# EAGLE design EMS_V2_1f (EAGLE 5.11)
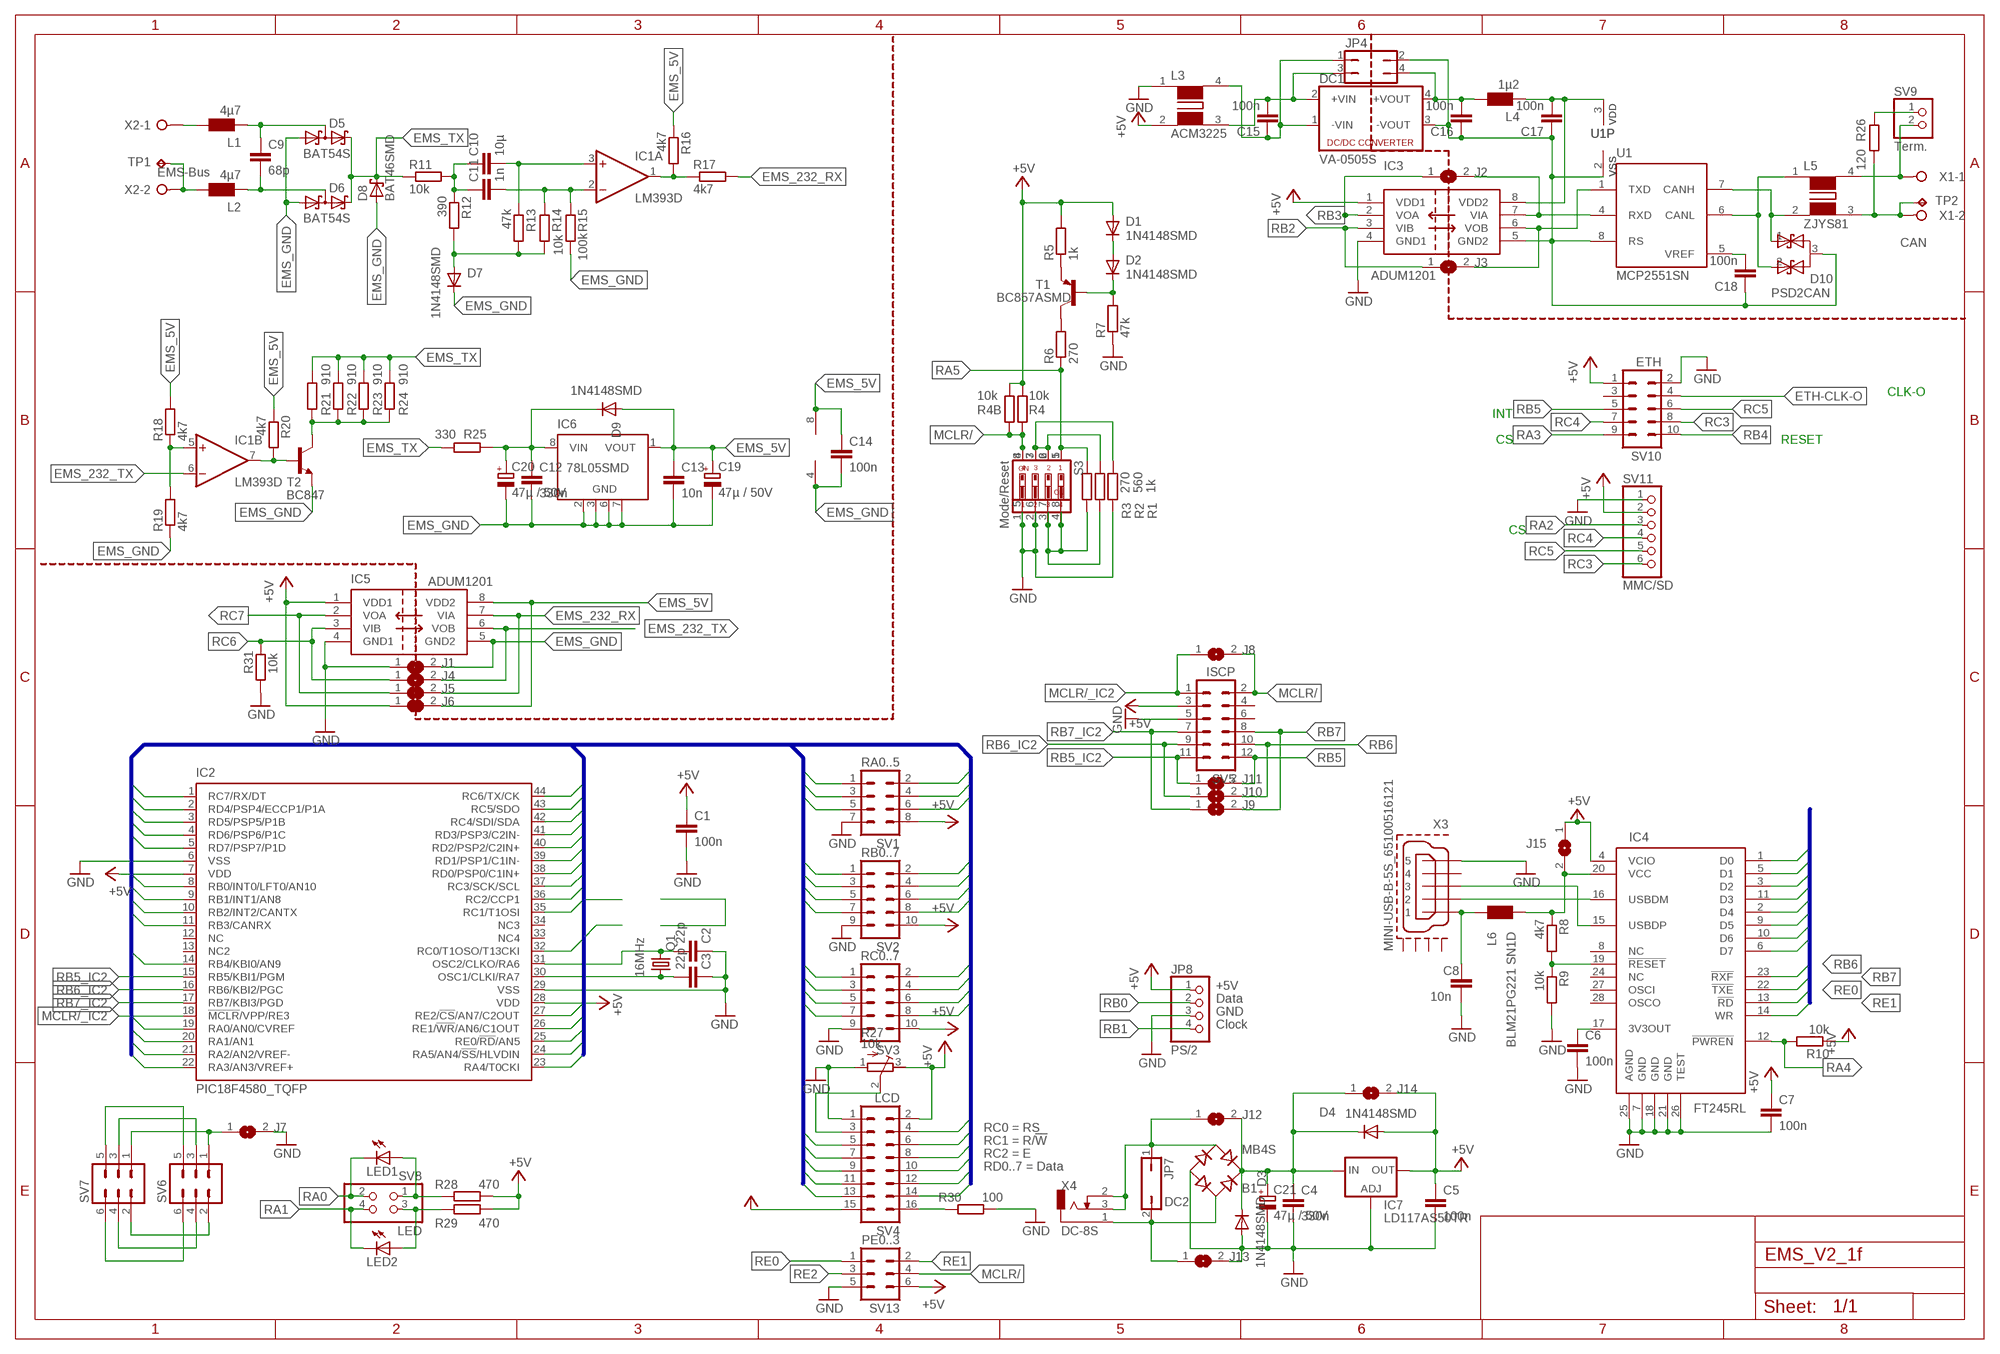
[diagram p0: schematic, sheet 1]

## Parts
B1  MB4S  [SOIC-4]
C1  100n  C-EUC0805  [C0805]
C2  22p  C-EUC0805  [C0805]
C3  22p  C-EUC0805  [C0805]
C4  330n  C-EUC0805  [C0805]
C5  100n  C-EUC0805  [C0805]
C6  100n  C-EUC0805  [C0805]
C7  100n  C-EUC0805  [C0805]
C8  10n  C-EUC0805  [C0805]
C9  68p  C-EUC0805  [C0805]
C10  10µ  C-EUC0805  [C0805]
C11  1n  C-EUC0805  [C0805]
C12  330n  C-EUC0805  [C0805]
C13  10n  C-EUC0805  [C0805]
C14  100n  C-EUC0805  [C0805]
C15  100n  C-EUC0805  [C0805]
C16  100n  C-EUC0805  [C0805]
C17  100n  C-EUC0805  [C0805]
C18  100n  C-EUC0805  [C0805]
C19  47µ / 50V  CPOL-EUE  [PANASONIC_E]
C20  47µ / 50V  CPOL-EUE  [PANASONIC_E]
C21  47µ / 50V  CPOL-EUE  [PANASONIC_E]
D1  1N4148SMD  [MINIMELF]
D2  1N4148SMD  [MINIMELF]
D3  1N4148SMD  [MINIMELF]
D4  1N4148SMD  [MINIMELF]
D5  BAT54S  [SOT23]
D6  BAT54S  [SOT23]
D7  1N4148SMD  [MINIMELF]
D8  BAT46SMD  [MINIMELF]
D9  1N4148SMD  [MINIMELF]
D10  PSD2CAN  [SOT23]
DC1  VA-0505S  [4SIL]
IC1  LM393D  [SO08]
IC2  PIC18F4580_TQFP  [TQFP44]
IC3  ADUM1201  [SO8]
IC4  FT245RL  [SSOP-28]
IC5  ADUM1201  [SO8]
IC6  78L05SMD  [SO08]
IC7  LD117AS50TR  [SOT223]
J1  SJ  [SJ]
J2  SJ  [SJ]
J3  SJ  [SJ]
J4  SJ  [SJ]
J5  SJ  [SJ]
J6  SJ  [SJ]
J7  SJ  [SJ]
J8  SJ  [SJ]
J9  SJ  [SJ]
J10  SJ  [SJ]
J11  SJ  [SJ]
J12  SJ  [SJ]
J13  SJ  [SJ]
J14  SJ  [SJ]
J15  SJ  [SJ]
JP4  JP2Q  [JP2Q]
JP7  DC2  JP1Q  [JP1]
JP8  PS/2  PINHD-1X4  [1X04]
L1  4µ7  WE-CBF_1210  [1210]
L2  4µ7  WE-CBF_1210  [1210]
L3  ACM3225  [ACM3225]
L4  1µ2  WE-CBF_1210  [1210]
L5  ZJYS81  [ZJYS81R5]
L6  BLM21PG221 SN1D  WE-KIHQ_0805  [WE-KI_0805_B]
LED1  LEDCHIPLED_1206  [CHIPLED_1206]
LED2  LEDCHIPLED_1206  [CHIPLED_1206]
Q1  16MHz  CRYSTALSM49  [SM49]
R1  1k  R-EU_R0805  [R0805]
R2  560  R-EU_R0805  [R0805]
R3  270  R-EU_R0805  [R0805]
R4  10k  R-EU_R0805  [R0805]
R4B  10k  R-EU_R0805  [R0805]
R5  1k  R-EU_R0805  [R0805]
R6  270  R-EU_R0805  [R0805]
R7  47k  R-EU_R0805  [R0805]
R8  4k7  R-EU_R0805  [R0805]
R9  10k  R-EU_R0805  [R0805]
R10  10k  R-EU_R0805  [R0805]
R11  10k  R-EU_R0805  [R0805]
R12  390  R-EU_R0805  [R0805]
R13  47k  R-EU_R0805  [R0805]
R14  10k  R-EU_R0805  [R0805]
R15  100k  R-EU_R0805  [R0805]
R16  4k7  R-EU_R0805  [R0805]
R17  4k7  R-EU_R0805  [R0805]
R18  4k7  R-EU_R0805  [R0805]
R19  4k7  R-EU_R0805  [R0805]
R20  4k7  R-EU_R0805  [R0805]
R21  910  R-EU_R0805  [R0805]
R22  910  R-EU_R0805  [R0805]
R23  910  R-EU_R0805  [R0805]
R24  910  R-EU_R0805  [R0805]
R25  330  R-EU_R0805  [R0805]
R26  120  R-EU_R0805  [R0805]
R27  10k  R-TRIMM3314J  [RTRIM3314J]
R28  470  R-EU_R0805  [R0805]
R29  470  R-EU_R0805  [R0805]
R30  100  R-EU_R0805  [R0805]
R31  10k  R-EU_R0805  [R0805]
S1  DHS104  [DHS104]
S3  Mode/Reset  SWS004  [SMS-004]
SV1  RA0..5  MA04-2  [MA04-2]
SV2  RB0..7  MA05-2  [MA05-2]
SV3  RC0..7  MA05-2  [MA05-2]
SV4  LCD  MA08-2  [MA08-2]
SV5  ISCP  MA06-2  [MA06-2]
SV6  MA03-2  [MA03-2]
SV7  MA03-2  [MA03-2]
SV8  LED  PINHD-2X2_2.54  [2X02]
SV9  Term.  PINHD-1X2  [1X02]
SV10  ETH  MA05-2  [MA05-2]
SV11  MMC/SD  PINHD-1X6  [1X06]
SV13  PE0..3  MA03-2  [MA03-2]
T1  BC857ASMD  [SOT23-BEC]
T2  BC847  [SOT23]
TP1  TPPAD1-13  [P1-13]
TP2  TPPAD1-13  [P1-13]
U1  MCP2551SN  [SO-08]
X1  CAN  W237-02P  [W237-132]
X2  EMS-Bus  W237-02P  [W237-132]
X3  MINI-USB-B-5S_65100516121  [65100516121]
X4  DC-8S  [DC-8S]

## Nets
+5V [Versorgung]: C1.1 C5.1 C7.1 D1.A D4.A IC2.7(VDD) IC2.28(VDD) IC3.1(VDD1) IC4.4(VCIO) IC5.1(VDD1) IC7.4(OUT) J6.1 J14.2 J15.1 JP8.1 L3.2 R4.1 R4B.1 R5.2 R10.1 R27.3(A) R28.1 R29.1 SV1.8 SV2.10 SV3.10 SV4.2 SV4.15 SV5.3 SV10.1 SV11.2 SV13.6
EMS_5V [Versorgung]: C13.1 C14.1 C19.+ D9.A IC1.8(P:V+) IC5.8(VDD2) IC6.1(VOUT) J6.2 R16.1 R18.2 R20.1
EMS_232_RX: IC5.7(VIA) J5.2 R17.2
EMS_232_TX: IC1.6(B:-IN) IC5.6(VOB) J4.2
EMS_GND [Versorgung]: C12.2 C13.2 C14.2 C19.- C20.- D5.1(A1) D6.1(A1) D7.C D8.A IC1.4(P:V-) IC5.5(GND2) IC6.2(GND) IC6.3(GND) IC6.6(GND) IC6.7(GND) J1.2 R15.2 R19.1 T2.2(E)
EMS_TX: D5.2(C2) D6.2(C2) D8.C R11.1 R21.1 R22.1 R23.1 R24.1 R25.1
ETH-CLK-O: SV10.4
GND [Versorgung]: B1.- C1.2 C2.1 C3.1 C4.2 C5.2 C6.2 C7.2 C8.2 C21.- D3.A IC2.6(VSS) IC2.29(VSS) IC3.4(GND1) IC4.7(GND) IC4.18(GND) IC4.21(GND) IC4.25(AGND) IC4.26(TEST) IC5.4(GND1) IC7.1(ADJ) J1.1 J7.2 J13.2 JP8.3 L3.1 R1.2 R7.1 R9.2 R27.1(E) R30.1 R31.2 S1.1 S1.2 S3.5 S3.6 SV1.7 SV2.9 SV3.9 SV4.1 SV5.5 SV10.2 SV11.1 SV13.5 X3.5
GND2 [Versorgung]: C16.1 C17.1 C18.1 D10.3 DC1.3(-VOUT) IC3.5(GND2) JP4.2 U1.2(VSS) U1.8(RS)
MCLR/: J8.2 R4.2 R4B.2 S1.8 S3.4 SV5.2 SV13.4
MCLR/_IC2: IC2.18(!MCLR!/VPP/RE3) J8.1 SV5.1
N$1: C9.2 D6.3(C1A2) L2.1
N$2: C2.2 IC2.31(OSC2/CLKO/RA6) Q1.2
N$3: C3.2 IC2.30(OSC1/CLKI/RA7) Q1.1
N$4: R27.2(S) SV4.3
N$5: R6.2 T1.C
N$6: IC3.6(VOB) J3.2 U1.1(TXD)
N$7: L2.2 TP1.TP X2.2
N$8: L1.2 X2.1
N$9: C10.1 C11.1 R11.2 R12.1
N$10: D7.A R12.2 R13.2 R14.2
N$11: IC1.1(A:OUT) R16.2 R17.1
N$12: C10.2 IC1.3(A:+IN) R13.1
N$13: C11.2 IC1.2(A:-IN) R14.1 R15.1
N$14: R5.1 T1.E
N$15: D10.1 L5.2 U1.7(CANH)
N$16: D10.2 L5.1 U1.6(CANL)
N$17: R1.1 R2.1 S1.6 S1.7 S3.2 S3.3
N$18 [Versorgung]: C12.1 C20.+ D9.C IC6.8(VIN) R25.2
N$19: R2.2 R3.2 S1.3 S1.4 S3.7 S3.8
N$20: L5.4 SV9.2 X1.1
N$21: R21.2 R22.2 R23.2 R24.2 T2.3(C)
N$22: IC1.5(B:+IN) R18.1 R19.2
N$23: IC1.7(B:OUT) R20.2 T2.1(B)
N$24: C9.1 D5.3(C1A2) L1.1
N$25: D1.C D2.A
N$26: C16.2 DC1.4(+VOUT) JP4.4 L4.2
N$27: L5.3 R26.1 TP2.TP X1.2
N$28: IC3.7(VIA) J2.2 U1.4(RXD)
N$29: J7.1 SV6.1 SV7.1
N$30: IC4.19(!RESET) R8.2 R9.1
N$31: SV6.3 SV7.3
N$32: SV6.5 SV7.5
N$33: D2.C R7.2 T1.B
N$34: B1.+ C4.1 C21.+ D3.C D4.C IC7.3(IN) J12.2 J14.1
N$35: SV6.2 SV7.2
N$36: C15.2 DC1.2(+VIN) JP4.3 L3.3
N$37: C15.1 DC1.1(-VIN) JP4.1 L3.4
N$38: SV6.4 SV7.4
N$39: C6.1 IC4.17(3V3OUT)
N$40: SV6.6 SV7.6
N$41: LED1.A R28.2 SV8.1
N$42: LED2.A R29.2 SV8.3
N$43: C18.2 U1.5(VREF)
N$44 [Versorgung]: B1.~1(AC1) J13.1 JP7.2 X4.1
N$45: R30.2 SV4.16
N$46: R26.2 SV9.1
N$47: B1.~2(AC2) J12.1 JP7.1 X4.2 X4.3
N$48: C8.1 L6.2 X3.1
RA0: IC2.19(RA0/AN0/CVREF) LED1.C SV1.1 SV8.2
RA1: IC2.20(RA1/AN1) LED2.C SV1.2 SV8.4
RA2: IC2.21(RA2/AN2/VREF-) SV1.3 SV11.3
RA3: IC2.22(RA3/AN3/VREF+) SV1.4 SV10.9
RA4: IC2.23(RA4/T0CKI) IC4.12(!PWREN) R10.2 SV1.5
RA5: IC2.24(RA5/AN4/!SS!/HLVDIN) R3.1 R6.1 S1.5 S3.1 SV1.6
RB0: IC2.8(RB0/INT0/LFT0/AN10) JP8.2 SV2.1
RB1: IC2.9(RB1/INT1/AN8) JP8.4 SV2.2
RB2: IC2.10(RB2/INT2/CANTX) IC3.3(VIB) J3.1 SV2.3
RB3: IC2.11(RB3/CANRX) IC3.2(VOA) J2.1 SV2.4
RB4: IC2.14(RB4/KBI0/AN9) SV2.5 SV10.10
RB5: J11.2 SV2.6 SV5.12 SV10.5
RB5_IC2: IC2.15(RB5/KBI1/PGM) J11.1 SV5.11
RB6: IC4.23(!RXF) J10.2 SV2.7 SV5.10
RB6_IC2: IC2.16(RB6/KBI2/PGC) J10.1 SV5.9
RB7: IC4.22(!TXE) J9.2 SV2.8 SV5.8
RB7_IC2: IC2.17(RB7/KBI3/PGD) J9.1 SV5.7
RC0: IC2.32(RC0/T1OSO/T13CKI) SV3.1 SV4.4
RC1: IC2.35(RC1/T1OSI) SV3.2 SV4.5
RC2: IC2.36(RC2/CCP1) SV3.3 SV4.6
RC3: IC2.37(RC3/SCK/SCL) SV3.4 SV10.8 SV11.6
RC4: IC2.42(RC4/SDI/SDA) SV3.5 SV10.7 SV11.4
RC5: IC2.43(RC5/SDO) SV3.6 SV10.6 SV11.5
RC6: IC2.44(RC6/TX/CK) IC5.3(VIB) J4.1 R31.1 SV3.7
RC7: IC2.1(RC7/RX/DT) IC5.2(VOA) J5.1 SV3.8
RD0: IC2.38(RD0/PSP0/C1IN+) IC4.1(D0) SV4.7
RD1: IC2.39(RD1/PSP1/C1IN-) IC4.5(D1) SV4.8
RD2: IC2.40(RD2/PSP2/C2IN+) IC4.3(D2) SV4.9
RD3: IC2.41(RD3/PSP3/C2IN-) IC4.11(D3) SV4.10
RD4: IC2.2(RD4/PSP4/ECCP1/P1A) IC4.2(D4) SV4.11
RD5: IC2.3(RD5/PSP5/P1B) IC4.9(D5) SV4.12
RD6: IC2.4(RD6/PSP6/P1C) IC4.10(D6) SV4.13
RD7: IC2.5(RD7/PSP7/P1D) IC4.6(D7) SV4.14
RE0: IC2.25(RE0/!RD!/AN5) IC4.13(!RD) SV13.1
RE1: IC2.26(RE1/!WR!/AN6/C1OUT) IC4.14(WR) SV13.2
RE2: IC2.27(RE2/!CS!/AN7/C2OUT) SV13.3
USB_VCC: IC4.20(VCC) J15.2 L6.1 R8.1
USBD+1: IC4.15(USBDP) X3.3
USBD-1: IC4.16(USBDM) X3.2
VCC2: C17.2 IC3.8(VDD2) L4.1 U1.3(VDD)
Unconnected: IC2.12(NC) IC2.13(NC2) IC2.33(NC4) IC2.34(NC3) IC4.8(NC) IC4.24(NC) IC4.27(OSCI) IC4.28(OSCO) IC6.4(NC) IC6.5(NC) SV5.4 SV5.6 SV10.3 X3.4 X3.S1(GND) X3.S2(GND) X3.S3(GND) X3.S4(GND)

## Buses
PORTS:RA[0..5],RB[0..7],RC[0..7],RD[0..7],RE[0..2]

## Notes on the sheet
- CLK-O
- INT
- CS | RESET
- CS
- +5V
- Data
- GND
- Clock
- RC0 = RS
- RC1 = R/!W!
- RC2 = E
- RD0..7 = Data

## Library data of the parts
B1 = rectifier:MB*S: Bridge Rectifier Source: http://www.fairchildsemi.com/ds/MB/MB6S.pdf
C1-C18 = rcl:C-EU: CAPACITOR, European symbol
C19-C21 = rcl:CPOL-EU: POLARIZED CAPACITOR, European symbol
D1-D4 D7 D9 = mod_diode:1N4148: DIODE high speed (Philips)
D5 D6 = mod_diode:BAT54S: Schottky Diodes Source: Fairchild .. BAT54.pdf
D8 = mod_diode:BAT46SMD
D10 = mod_diode:PSD2CAN: Dual Line CAN Bus Protector
DC1 = dc-dc-converter:VA-*?: DC DC Converter Single Output, 1 Watt Motien Technology Co.,Ltd. Source: va-serie.pdf; OC_FARNELL: unknown; OC_NEWARK: unknown
IC1 = linear:LM393: COMPARATOR
IC2 = microchip_mod:PIC18F4580_TQFP: Enhanced Flash Microcontrollers with ECAN Technology 10-Bit A/D an nanoWatt Technology Source: http://ww1.microchip.com/downloads/en/devicedoc/39637c.pdf
IC3 IC5 = adum140x:ADUM1201
IC4 = FTDI:FT245RL: FT245RL USB to parallel FIFO interface
IC6 = linear:78L*SMD: Positive VOLTAGE REGULATOR
IC7 = v-reg:LD117A?*: Low drop fixed and adjustable positive voltage regulators 1 A Source: http://www.st.com/stonline/products/literature/ds/7194/ld1117axx.pdf
J1-J15 = jumper:SJ: SMD solder JUMPER
JP4 = jumper:JP2Q: JUMPER
JP7 = jumper:JP1Q: JUMPER
JP8 = pinhead:PINHD-1X4: PIN HEADER
L1 L2 L4 = wuerth-elektronik:WE-CBF: SMD EMI Suppression Ferrite Beads - excellent anti-EMI properties - low DCR - impedances till 3000 ohms - rated current up to 6 A
L3 = TDK:ACM3225: TDK ACM3225 Common Mode Filters for Power Line SMD
L5 = TDK:ZJYS81: Common Mode Filters For automobile signal line ZJYS series
L6 = wuerth-elektronik:WE-KIHQ: SMD Wire Wound Ceramic Inductor WE-KIHQ - High current - Highest Quality factor in size 0805 - up to 98 - High thermal stability - High SRF -- Bluetooth -- Wireless LAN -- RF oscillation circuit -- IF impedance matching -- IG choke
LED1 LED2 = led:LED: LED OSRAM: - CHIPLED LG R971, LG N971, LY N971, LG Q971, LY Q971, LO R971, LY R971 LH N974, LH R974 LS Q976, LO Q976, LY Q976 LO Q996 - Hyper CHIPLED LW Q18S LB Q993, LB Q99A, LB R99A - SideLED LS A670, LO A670, LY A670, LG A670, LP A670 LB A673, LV A673, LT A673, LW A673 LH A674 LY A675 LS A676, LA A676, LO A676, LY A676, LW A676 LS A679, LY A679, LG A679 - Hyper Micro SIDELED® LS Y876, LA Y876, LO Y876, LY Y876 LT Y87S - SmartLED LW L88C, LW L88S LB L89C, LB L89S, LG L890 LS L89K, LO L89K, LY L89K LS L896, LA L896, LO L896, LY L896 - TOPLED LS T670, LO T670, LY T670, LG T670, LP T670 LSG T670, LSP T670, LSY T670, LOP T670, LYG T670 LG T671, LOG T671, LSG T671 LB T673, LV T673, LT T673, LW T673 LH T674 LS T676, LA T676, LO T676, LY T676, LB T676, LH T676, LSB T676, LW T676 LB T67C, LV T67C, LT T67C, LS T67K, LO T67K, LY T67K, LW E67C LS E67B, LA E67B, LO E67B, LY E67B, LB E67C, LV E67C, LT E67C LW T67C LS T679, LY T679, LG T679 LS T770, LO T770, LY T770, LG T770, LP T770 LB T773, LV T773, LT T773, LW T773 LH T774 LS E675, LA E675, LY E675, LS T675 LS T776, LA T776, LO T776, LY T776, LB T776 LHGB T686 LT T68C, LB T68C - Hyper Mini TOPLED® LB M676 - Mini TOPLED Santana® LG M470 LS M47K, LO M47K, LY M47K Source: http://www.osram.convergy.de LUXEON: - LUMILED® LXK2-PW12-R00, LXK2-PW12-S00, LXK2-PW14-U00, LXK2-PW14-V00 LXK2-PM12-R00, LXK2-PM12-S00, LXK2-PM14-U00 LXK2-PE12-Q00, LXK2-PE12-R00, LXK2-PE12-S00, LXK2-PE14-T00, LXK2-PE14-U00 LXK2-PB12-K00, LXK2-PB12-L00, LXK2-PB12-M00, LXK2-PB14-N00, LXK2-PB14-P00, LXK2-PB14-Q00 LXK2-PR12-L00, LXK2-PR12-M00, LXK2-PR14-Q00, LXK2-PR14-R00 LXK2-PD12-Q00, LXK2-PD12-R00, LXK2-PD12-S00 LXK2-PH12-R00, LXK2-PH12-S00 LXK2-PL12-P00, LXK2-PL12-Q00, LXK2-PL12-R00 Source: www.luxeon.com KINGBRIGHT: KA-3528ASYC Source: www.kingbright.com
Q1 = crystal:CRYSTAL: CRYSTAL; OC_FARNELL: unknown; OC_NEWARK: unknown
R1-R4 R4B R5-R26 R28-R31 = resistor:R-EU_: RESISTOR, European symbol
R27 = resistor:R-TRIMM: Trimm resistor
S1 = switch-dil_mod:DHS104
S3 = smd-special:SWS004: SMD Dip Switch 4 pol.
SV1 = con-lstb:MA04-2: PIN HEADER; OC_FARNELL: unknown; OC_NEWARK: unknown
SV2 SV3 SV10 = con-lstb:MA05-2: PIN HEADER; OC_FARNELL: unknown; OC_NEWARK: unknown
SV4 = con-lstb:MA08-2: PIN HEADER; OC_FARNELL: unknown; OC_NEWARK: unknown
SV5 = con-lstb:MA06-2: PIN HEADER; OC_FARNELL: unknown; OC_NEWARK: unknown
SV6 SV7 SV13 = con-lstb:MA03-2: PIN HEADER; OC_FARNELL: unknown; OC_NEWARK: unknown
SV8 = pinhead:PINHD-2X2: PIN HEADER
SV9 = pinhead:PINHD-1X2: PIN HEADER
SV11 = pinhead:PINHD-1X6: PIN HEADER
T1 = transistor-pnp:BC857*: PNP Transistror
T2 = transistor:BC847: NPN TRANSISTOR
TP1 TP2 = testpad:TP: Test pad
U1 = microchip_can:MCP2551: High Speed CAN tranceiver
X1 X2 = con-wago-508:W237-02P: WAGO SREW CLAMP; OC_FARNELL: unknown; OC_NEWARK: unknown
X3 = wuerth:MINI-USB-B-5S_65100516121: Würth SMT Mini-USB Type B 5Polig mit Schirm
X4 = con-dc:DC-8S

## Net classes
0 default: width 0.356 mm, clearance 0.15 mm
1 Versorgung: width 0.914 mm, clearance 0.15 mm

## Board
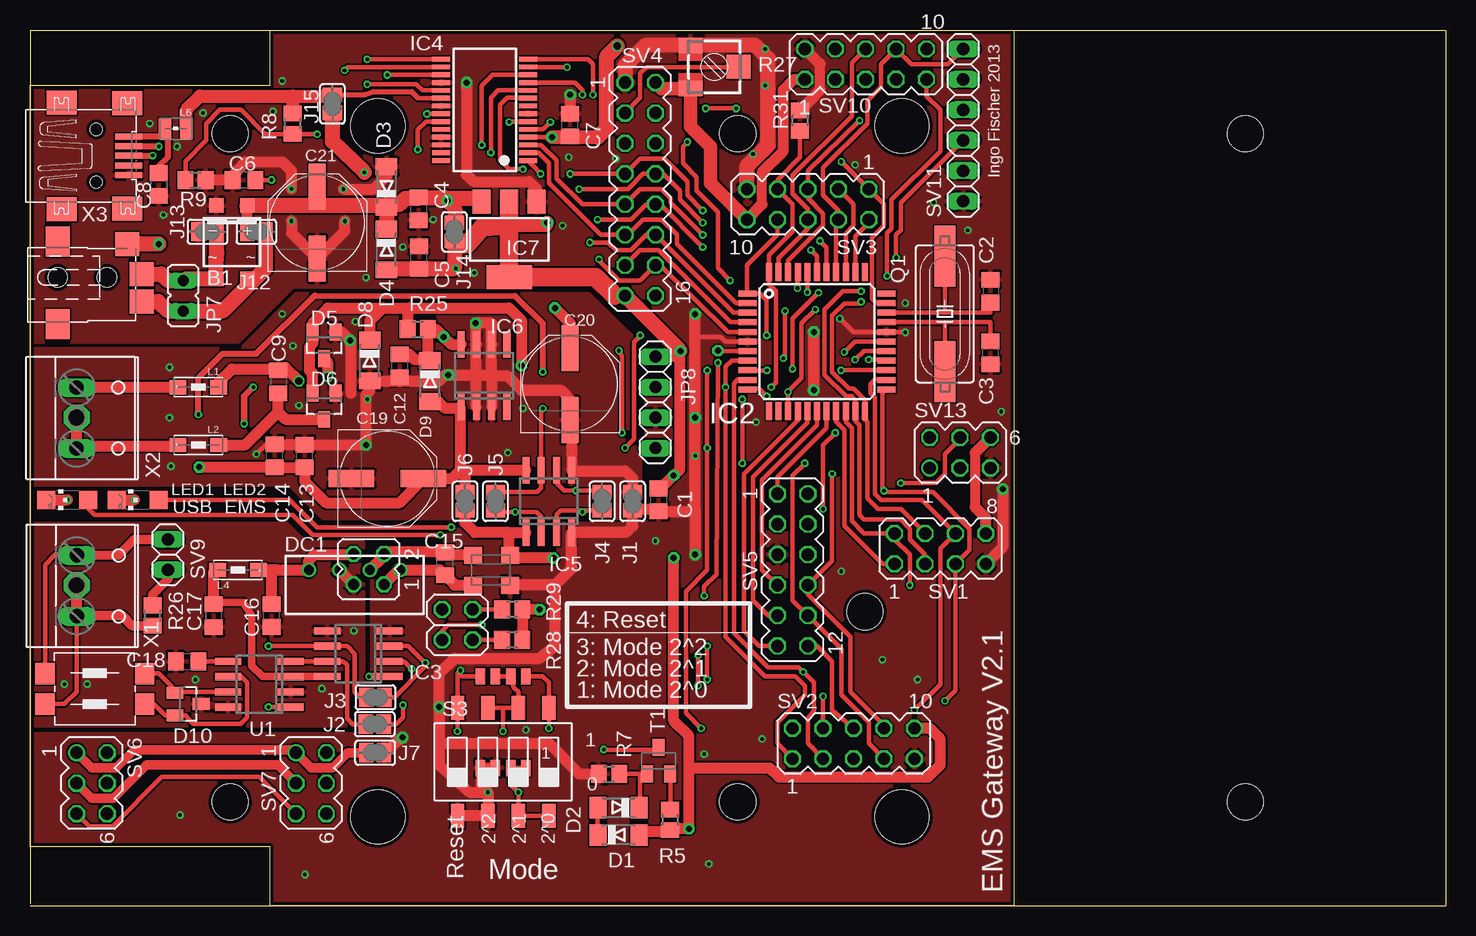
[diagram p1: board, top side]
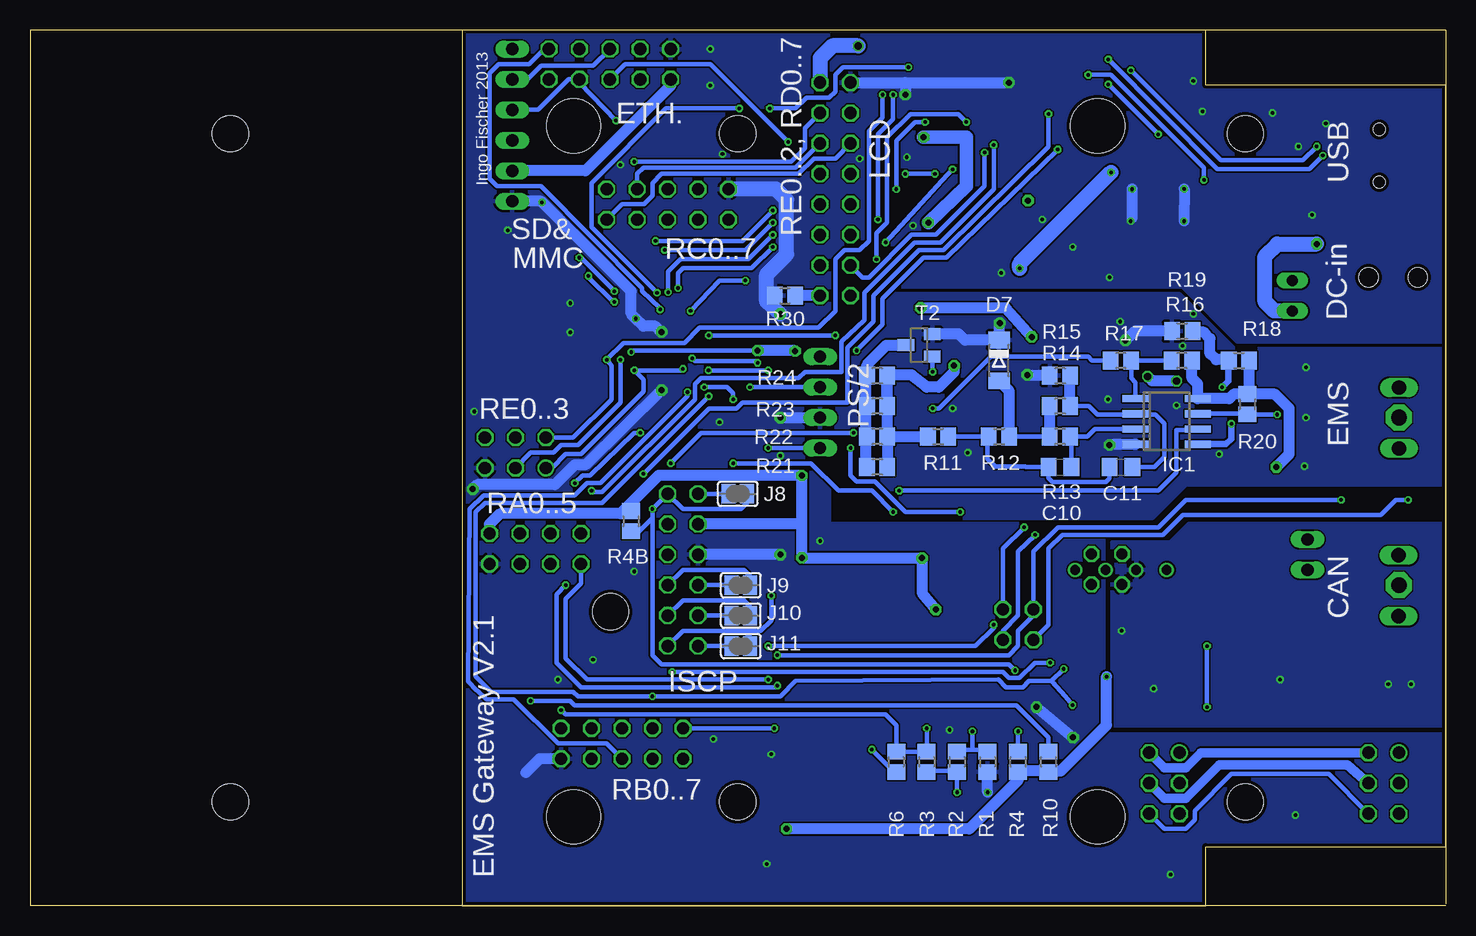
[diagram p2: board, bottom side, seen from below]

Size 118 x 73 mm. Coordinates in mm from the lower left corner, seen from the top.
Outline: 0,0.13 0,73 118,73 118,0 0,0
Outline: 82,0 20,0 20,4.9 0,4.9 0,68.4 20,68.4 20,73 82,73 82,0
Copper layers (1*16): Top 0.035mm / dielectric 1.5mm / Bottom 0.035mm
Design rules "PCB-POOL Standard": minimum track width 0.15mm, minimum drill 0.3mm, track to track 0.15mm, track to pad 0.15mm, pad to pad 0.15mm, via to via 0.15mm, smd to smd 0.15mm, copper to edge 0.3mm, drill to drill 0.2mm, minimum pad ring 0.2mm, minimum via ring 0.15mm, stop-mask expansion 0.075mm, vias tented up to drill 0mil, thermal gap 0.2mm
Holes 4.5 mm at 72.7,7.4 29,7.4 72.7,65 29,65
Holes 3 mm at 16.7,8.65 59,8.65 69.6,24.5 16.7,64.35 59,64.35 101.3,8.65 101.3,64.35
bKeepout: area 69.9,4.7 to 75.4,10.2; area 26.2,4.7 to 31.8,10.2; area 69.9,62.2 to 75.4,67.8; area 26.2,62.2 to 31.8,67.8; area 13.7,5.7 to 19.7,11.7; area 56,5.7 to 62,11.7; area 66.6,21.5 to 72.6,27.5; area 13.7,61.4 to 19.7,67.4; area 56,61.4 to 62,67.4; area 98.3,5.7 to 104.3,11.7; area 98.3,61.4 to 104.3,67.4

### Footprints (pad centres in the part's own frame; a part is rotated, then mirrored left to right if it is on the bottom)
SOIC-4 = smd 1.2 x 1.2: + 1.3,3.05; - -1.3,3.05; ~1 -1.3,-3.05; ~2 1.3,-3.05
C0805 = smd 1.3 x 1.5: 1 -0.95,0; 2 0.95,0
PANASONIC_E = smd 3.8 x 1.4: + 3,0; - -3,0
MINIMELF = smd 1.4 x 1.8: A 1.7,0; C -1.7,0
SOT23 = smd 1 x 1.4: 1 -0.95,-1.1; 2 0.95,-1.1; 3 0,1.1
4SIL = drill 0.8 round: 1 -3.81,0; 2 -1.27,0; 3 1.27,0; 4 3.81,0
SO08 = smd 0.6 x 2.2: 1 -1.905,-2.6; 2 -0.635,-2.6; 3 0.635,-2.6; 4 1.905,-2.6; 5 1.905,2.6; 6 0.635,2.6; 7 -0.635,2.6; 8 -1.905,2.6
TQFP44 = smd 1.5 x 0.5: 1 -5.8,4; 2 -5.8,3.2; 3 -5.8,2.4; 4 -5.8,1.6; 5 -5.8,0.8; 6 -5.8,0; 7 -5.8,-0.8; 8 -5.8,-1.6; 9 -5.8,-2.4; 10 -5.8,-3.2; 11 -5.8,-4; 23 5.8,-4; 24 5.8,-3.2; 25 5.8,-2.4; 26 5.8,-1.6; 27 5.8,-0.8; 28 5.8,0; 29 5.8,0.8; 30 5.8,1.6; 31 5.8,2.4; 32 5.8,3.2; 33 5.8,4 | smd 0.5 x 1.5: 12 -4,-5.8; 13 -3.2,-5.8; 14 -2.4,-5.8; 15 -1.6,-5.8; 16 -0.8,-5.8; 17 0,-5.8; 18 0.8,-5.8; 19 1.6,-5.8; 20 2.4,-5.8; 21 3.2,-5.8; 22 4,-5.8; 34 4,5.8; 35 3.2,5.8; 36 2.4,5.8; 37 1.6,5.8; 38 0.8,5.8; 39 0,5.8; 40 -0.8,5.8; 41 -1.6,5.8; 42 -2.4,5.8; 43 -3.2,5.8; 44 -4,5.8
SO8 = smd 0.6 x 2.2: 1 -1.905,-2.6; 2 -0.635,-2.6; 3 0.635,-2.6; 4 1.905,-2.6; 5 1.905,2.6; 6 0.635,2.6; 7 -0.635,2.6; 8 -1.905,2.6
SSOP-28 = smd 0.4 x 1.5: 1 -4.225,-3.625; 2 -3.575,-3.625; 3 -2.925,-3.625; 4 -2.275,-3.625; 5 -1.625,-3.625; 6 -0.975,-3.625; 7 -0.325,-3.625; 8 0.325,-3.625; 9 0.975,-3.625; 10 1.625,-3.625; 11 2.275,-3.625; 12 2.925,-3.625; 13 3.575,-3.625; 14 4.225,-3.625; 15 4.225,3.625; 16 3.575,3.625; 17 2.925,3.625; 18 2.275,3.625; 19 1.625,3.625; 20 0.975,3.625; 21 0.325,3.625; 22 -0.325,3.625; 23 -0.975,3.625; 24 -1.625,3.625; 25 -2.275,3.625; 26 -2.925,3.625; 27 -3.575,3.625; 28 -4.225,3.625
SOT223 = smd 1.5 x 2: 1 -2.3,-3.15; 2 0,-3.15; 3 2.3,-3.15 | smd 3.8 x 2: 4 0,3.15
SJ = smd 1.168 x 1.6: 1 -0.762,0; 2 0.762,0
JP2Q = drill 0.914 octagon: 1 -1.27,-1.27; 2 -1.27,1.27; 3 1.27,-1.27; 4 1.27,1.27
JP1 = drill 0.914 long: 1 0,-1.27; 2 0,1.27
1X04 = drill 1.016 long: 1 -3.81,0; 2 -1.27,0; 3 1.27,0; 4 3.81,0
1210 = smd 1.4 x 1.2: 1 -1.7,0; 2 1.7,0
ACM3225 = smd 1.5 x 1.4: 1 -1.6,1.3; 2 -1.6,-1.2; 3 1.5,-1.2; 4 1.5,1.3
ZJYS81R5 = smd 1.6 x 1.8: 1 -4.15,1.27; 2 -4.15,-1.27; 3 4.15,1.27; 4 4.15,-1.27
WE-KI_0805_B = smd 1.02 x 1.78: 1 -0.89,0; 2 0.89,0
CHIPLED_1206 = smd 1.5 x 1.5: A 0,-1.75; C 0,1.75
SM49 = smd 5.08 x 1.778: 1 -4.826,0; 2 4.826,0
R0805 = smd 1.3 x 1.5: 1 -0.85,0; 2 0.85,0
RTRIM3314J = smd 1.3 x 2: 1 -1.8,-2; 3 1.8,-2 | smd 2 x 2: 2 0,2
DHS104 = smd 0.8 x 1.35: 1 -1.906,-3.823; 2 -0.635,-3.823; 3 0.635,-3.823; 4 1.906,-3.823; 5 1.905,3.825; 6 0.635,3.822; 7 -0.634,3.825; 8 -1.905,3.825
SMS-004 = smd 1.092 x 2.007: 1 -3.81,-4.496; 2 -1.27,-4.496; 3 1.27,-4.496; 4 3.81,-4.496; 5 3.81,4.496; 6 1.27,4.496; 7 -1.27,4.496; 8 -3.81,4.496
MA04-2 = drill 1.016 octagon: 1 -3.81,-1.27; 2 -3.81,1.27; 3 -1.27,-1.27; 4 -1.27,1.27; 5 1.27,-1.27; 6 1.27,1.27; 7 3.81,-1.27; 8 3.81,1.27
MA05-2 = drill 1.016 octagon: 1 -5.08,-1.27; 2 -5.08,1.27; 3 -2.54,-1.27; 4 -2.54,1.27; 5 0,-1.27; 6 0,1.27; 7 2.54,-1.27; 8 2.54,1.27; 9 5.08,-1.27; 10 5.08,1.27
MA08-2 = drill 1.016 octagon: 1 -8.89,-1.27; 2 -8.89,1.27; 3 -6.35,-1.27; 4 -6.35,1.27; 5 -3.81,-1.27; 6 -3.81,1.27; 7 -1.27,-1.27; 8 -1.27,1.27; 9 1.27,-1.27; 10 1.27,1.27; 11 3.81,-1.27; 12 3.81,1.27; 13 6.35,-1.27; 14 6.35,1.27; 15 8.89,-1.27; 16 8.89,1.27
MA06-2 = drill 1.016 octagon: 1 -6.35,-1.27; 2 -6.35,1.27; 3 -3.81,-1.27; 4 -3.81,1.27; 5 -1.27,-1.27; 6 -1.27,1.27; 7 1.27,-1.27; 8 1.27,1.27; 9 3.81,-1.27; 10 3.81,1.27; 11 6.35,-1.27; 12 6.35,1.27
MA03-2 = drill 1.016 round: 1 -2.54,-1.27 | drill 1.016 octagon: 2 -2.54,1.27; 3 0,-1.27; 4 0,1.27; 5 2.54,-1.27; 6 2.54,1.27
2X02 = drill 1.016 octagon: 1 -1.27,-1.27; 2 -1.27,1.27; 3 1.27,-1.27; 4 1.27,1.27
1X02 = drill 1.016 long: 1 -1.27,0; 2 1.27,0
1X06 = drill 1.016 long: 1 -6.35,0; 2 -3.81,0; 3 -1.27,0; 4 1.27,0; 5 3.81,0; 6 6.35,0
SOT23-BEC = smd 1 x 1.4: B -0.95,-1.1; C 0,1.1; E 0.95,-1.1
P1-13 = drill 1.321 pad 2.159 octagon: TP 0,0
SO-08 = smd 0.6 x 2.2: 1 -1.905,-2.6; 2 -0.635,-2.6; 3 0.635,-2.6; 4 1.905,-2.6; 5 1.905,2.6; 6 0.635,2.6; 7 -0.635,2.6; 8 -1.905,2.6
W237-132 = drill 1.194 long: 1 -2.54,-0.635; 2 2.54,-0.635
65100516121 = smd 2.25 x 0.5: 1 8.555,1.6; 2 8.555,0.8; 3 8.555,0; 4 8.555,-0.8; 5 8.555,-1.6 | smd 2.5 x 2: S1 2.98,4.45; S2 2.98,-4.45; S3 8.43,4.4; S4 8.43,-4.4 | hole 1: 5.85,2.2; 5.85,-2.2
DC-8S = smd 2 x 2: 1 9.5,0.3; 2 9.5,-2; 3 8.3,2.8 | smd 2 x 2.5: 4@1 2.5,3; 4@2 2.5,-3.9 | hole 1.6: 2.5,0; 6.6,0

### Placement (x,y rotation side)
B1  16.83,55.31 0 top
C1  52.41,33.82 270 top
C2  80.08,51.22 270 top
C3  80.08,46.08 90 top
C4  32.39,58.08 270 top
C5  32.43,54.02 90 top
C6  17.85,60.49 180 top
C7  45.03,65.07 90 top
C8  10.74,60.11 270 top
C9  20.71,43.67 270 top
C10  32.14,36.56 0 bottom
C11  27.06,36.55 0 bottom
C12  30.8,45.01 270 top
C13  22.9,37.48 90 top
C14  20.39,37.51 90 top
C15  34.61,28.49 90 top
C16  20.15,24.18 90 top
C17  15.33,24.16 90 top
C18  13.1,20.36 0 top
C19  29.79,35.6 0 top
C20  45.03,43.48 90 top
C21  23.95,56.94 90 top
D1  49.06,5.88 0 top
D2  49.06,8.17 180 top
D3  29.71,59.91 90 top
D4  29.71,54.7 270 top
D5  24.52,46.71 180 top
D6  24.52,41.63 180 top
D7  37.22,45.45 270 bottom
D8  28.33,45.45 270 top
D9  33.34,43.73 270 top
D10  13.18,16.8 270 top
DC1  27.06,27.98 180 top
IC1  23.25,40.36 270 bottom
IC2  65.6,47.03 0 top
IC3  27.38,21 90 top
IC4  37.92,66.34 90 top
IC5  43.25,33.7 0 top
IC6  37.85,44.17 0 top
IC7  39.95,55.54 180 top
J1  50.23,33.7 90 top
J2  28.74,15.12 180 top
J3  28.8,17.35 180 top
J4  47.7,33.7 90 top
J5  38.8,33.7 90 top
J6  36.27,33.7 90 top
J7  28.77,12.74 0 top
J8  59,34.33 0 bottom
J9  58.74,26.71 0 bottom
J10  58.74,24.17 0 bottom
J11  58.74,21.63 0 bottom
J12  18.87,56.18 180 top
J13  14.8,56.18 180 top
J14  35.38,56.18 270 top
J15  25.22,66.84 90 top
JP4  28.24,28.04 90 top
JP7  12.77,50.84 0 top
JP8  52.14,41.95 270 top
L1  14.04,43.22 180 top
L2  14.04,38.4 180 top
L3  38.42,27.98 180 top
L4  17.34,27.98 0 top
L5  5.4,18.08 180 top
L6  12.15,64.78 180 top
LED1  3.12,33.82 90 top
LED2  8.96,33.82 90 top
Q1  76.27,49.34 90 top
R1  38.17,11.98 270 bottom
R2  40.71,11.98 270 bottom
R3  43.26,11.98 270 bottom
R4  35.63,11.98 90 bottom
R4B  67.89,32.05 270 bottom
R5  53.35,7.15 270 top
R6  45.79,11.98 270 bottom
R7  48.27,10.96 0 top
R8  21.88,65.18 270 top
R9  13.8,60.48 0 top
R10  33.09,11.98 90 bottom
R11  42.3,39.09 0 bottom
R12  37.22,39.09 0 bottom
R13  32.14,39.09 180 bottom
R14  32.14,41.63 180 bottom
R15  32.14,44.17 180 bottom
R16  21.98,45.45 180 bottom
R17  27.06,45.45 180 bottom
R18  17.21,45.45 0 bottom
R19  21.95,47.89 0 bottom
R20  16.52,41.79 270 bottom
R21  47.38,36.55 180 bottom
R22  47.38,39.09 180 bottom
R23  47.38,41.63 180 bottom
R24  47.38,44.17 180 bottom
R25  32.33,48.05 0 top
R26  10.23,24.17 90 top
R27  57.05,69.92 270 top
R28  40.2,22.14 180 top
R29  40.2,24.68 180 top
R30  55.06,50.84 0 bottom
R31  64.2,65.45 90 top
S1  39.44,15.28 0 top
S3  39.44,11.98 180 top
SV1  75.89,29.76 0 top
SV2  68.65,13.5 0 top
SV3  64.84,58.46 180 top
SV4  50.87,59.73 270 top
SV5  63.57,27.98 270 top
SV6  5.15,10.2 270 top
SV7  23.44,10.2 270 top
SV8  35.63,23.41 90 top
SV9  11.5,29.25 90 top
SV10  69.67,70.15 0 top
SV11  77.79,65.07 90 top
SV13  77.54,37.76 0 top
T1  52.39,12.08 0 top
T2  43.88,46.71 90 bottom
TP1  3.88,40.68 90 top
TP2  3.88,26.71 90 top
U1  19.12,18.45 90 top
X1  4.54,26.66 270 top
X2  4.52,40.64 270 top
X3  -0.34,62.5 0 top
X4  -0.18,52.37 0 top

### Tracks (layer width: path | path; a pad name or v marks a point on that pad's centre or on a via)
+5V  (via drill 0.3, 0.5 pad 0.95, 0.6)
  Top 0.356: v43.5,64.06 IC4.4 41.53,64.05 | 54.17,46.27 v54.21,46.23 | v67.89,46.14 68.78,47.03 IC2.28 | IC2.7 57.38,46.23 v57.35,46.27 | 39.95,56.68 40.2,56.56
  Top 0.61: v28.26,19.09 IC3.1
  Top 0.813: 61.03,58.46 61.03,61.13 | 78.81,33.19 78.81,37.76
  Top 0.914: C7.1 44.97,64.06 arc90 C7.1 | SV3.10 | SV3.10 60.01,57.45 SV3.10 | SV3.10 | SV2.10 75,14.77 75.89,13.89 75.89,11.73 74.87,10.71 62.43,10.71 61.66,11.47 54.93,11.47 | 54.17,45.76 54.17,46.27 | 54.17,45.76 54.17,36.36 v53.66,35.86 52.65,34.84 C1.1 | 54.17,45.76 JP8.1 | C7.1 45.03,64.05 | D1.A 50.87,6.14 53.16,6.14 R5.2 53.66,6.39 v54.93,6.39 54.93,11.47 | 54.93,11.47 54.93,14.14 53.66,15.41 v53.66,29 | v43.63,28.97 40.24,28.97 L3.2 39.95,29.18 39.95,31.1 | J6.1 36.27,31.92 37.09,31.1 39.95,31.1 | R28.1 R29.1 v42.49,24.68 | 39.95,31.1 41.12,31.1 41.22,31.08 IC5.1 | 35.38,53.13 v35.5,53.13 35.44,53.07 35.25,53.07 | R27.3 55.06,68.11 | 29.98,53.07 29.91,53 29.91,53.07 | 61.03,61.13 62.81,62.91 62.81,67.99 63.7,68.88 SV10.1 | SV3.10 61.03,58.46 | 78.81,37.76 SV13.6 | SV1.8 79.7,32.3 78.81,33.19
  Top 1.143: SV3.10 56.71,60.24 56.71,63.29 55.06,64.94 55.06,68.11 | 45.03,64.05 47.31,64.05 | v43.5,64.06 44.97,64.06 | R27.3 52.65,68.12 SV4.2 | 43,56.81 v43.12,56.94 | 35.38,54.91 35.38,55.16 J14.2
  Top 1.27: 54.17,46.27 SV4.15 48.71,50.84 | D4.A 29.78,53.07 29.91,53.07 29.98,53.07 C5.1 35.25,53.07 | 35.38,54.91 35.38,53.13 | J15.1 25.22,63.67 v27.88,61.13 | 39.95,56.81 43,56.81 | 39.95,56.81 40.08,56.56 39.95,56.56 | 39.95,56.81 40.2,56.56 | 47.31,64.05 48.08,64.81 48.08,70.78 v48.97,71.67
  Top 1.524: 48.71,50.84 47.16,52.39 IC7.4 39.95,56.56 39.95,56.68 | 39.95,56.68 39.95,56.81 39.95,58.84 | 39.95,56.68 37.74,56.56 36.47,55.16 35.38,55.16
  Bottom 0.254: v53.66,29 53.63,28.97
  Bottom 0.356: v54.21,46.23 54.25,46.27 | v67.89,46.14 67.63,46.27 v57.35,46.27 | 68.78,32.68 68.27,32.68 R4B.1 | 39.95,59.99 40.46,59.22 40.46,59.07 42.72,56.81 v43.12,56.94
  Bottom 0.914: v53.66,29 53.66,31.79 | v28.26,19.09 28.26,15.03 32.07,11.22 32.84,11.22 R10.1 33.09,11.22 35.63,11.22 R4.1 35.63,10.46 39.69,6.39 v54.93,6.39 | 53.66,31.79 SV5.3 | 53.66,31.79 v53.66,35.86 65.6,35.86 68.78,32.68 78.81,32.68 79.06,32.43 79.7,31.79 SV1.8 | 54.25,46.27 v57.35,46.27 | 39.95,64.06 39.94,64.06 | 53.63,28.97 v43.63,28.97 43.63,26.08 v42.49,24.68 | SV11.2 71.7,61.26 64.59,68.37 SV10.1
  Bottom 1.143: v43.12,56.94 39.95,59.99 39.95,64.06 v43.5,64.06
  Bottom 1.27: v27.88,61.13 35.5,53.51 v35.5,53.13 | v48.97,71.67 51.12,71.67 52.14,70.65 SV4.2
EMS_5V  (via drill 0.5 pad 0.95)
  Top 0.15: 35.88,41.44 IC6.1
  Top 0.914: 36.27,36.3 IC5.8 | 35.88,36.3 36.27,36.3 | 36.27,36.3 J6.2 | 35.88,36.3 35.88,41.44 34.61,41.44 34.03,42.03 D9.A | v14.1,36.56 C14.1 20.39,36.53 C13.1 22.91,35.37 24.71,33.57 30.8,33.57 32.69,35.48 | 35.88,36.3 35.19,35.6 32.84,35.6 32.69,35.48 | C19.+ 32.79,35.58 32.69,35.48
  Bottom 0.914: R20.1 17.67,42.64 18.04,42.27 IC1.8 20.65,43.48 21.13,43.96 R16.1 | R20.1 arc90 16.45,42.71 | R18.2 16.37,42.89 16.52,42.89 R20.1 | v14.1,36.56 13.02,37.63 13.02,41.44 14.22,42.64 R20.1
EMS_232_RX  (via drill 0.3)
  Top 0.356: J5.2 42.27,34.46 42.62,34.81 IC5.7 42.62,41.32 v42.74,41.44
  Bottom 0.356: R17.2 29.47,45.45 29.79,45.76 37.92,45.76 42.23,41.44 v42.74,41.44
EMS_232_TX  (via drill 0.3)
  Top 0.356: IC5.6 43.88,35.22 44.52,34.59 v45.54,34.59 47.57,34.59 arc-90 J4.2
  Bottom 0.356: v45.54,34.59 23.95,34.59 22.42,36.11 22.42,39.67 20.71,39.67 IC1.6
EMS_GND  (via drill 0.3, 0.5 pad 0.95)
  Top 0.356: C14.2 19.69,38.46 v18.87,37.63
  Top 0.914: J1.2 50.23,35.6 49.6,36.24 45.22,36.24 IC5.5 45.16,42.08 44.27,42.97 40.96,42.97 39.76,44.18 38.49,44.18 | D6.1 25.62,42.59 | 37.15,46.84 v37.15,48.56 38.42,48.56 38.49,48.49 IC6.6 38.49,44.18 | 37.15,46.84 IC6.7 | 37.15,46.84 37.15,41.64 IC6.2 | 38.49,44.18 IC6.3 | 38.49,44.18 38.42,44.24 v34.87,44.24 34.61,44.24 34.12,43.75 31.06,43.75 | 31.06,43.75 D8.A 28.33,42.9 28.01,42.59 v28.01,38.4 C13.2 C14.2 | 25.96,47.82 25.98,47.82 26.74,47.05 26.74,42.71 | 25.96,47.82 D5.1 | v26.69,47.11 25.96,47.82 | C12.2 30.8,44 31.06,43.75
  Bottom 0.356: v37.15,48.56 37.22,48.49 | v28.01,38.4 28.01,38.46
  Bottom 0.914: T2.2 40.58,47.67 40.06,47.14 D7.C 37.22,48.49 | R15.2 33.05,44.24 v34.87,44.24 | 28.01,38.46 IC1.4 | v26.69,47.11 25.88,47.89 R19.1
  other vias: 11.63,44.87 11.75,36.62 27.12,48.68 21.02,49.32 11.63,40.68 39.82,37.76 41.09,41.44 28.14,42.21 22.42,41.7 21.91,46.65
  pour Bottom: 0.07,35.09 0.07,46.4 17.6,46.4 22.17,50.97 46.55,50.97 50.87,46.78 50.87,32.3 24.45,32.3 21.66,35.09
  pour Top: 0.07,35.09 0.07,46.4 17.6,46.4 22.17,50.97 46.55,50.97 50.87,46.78 50.87,32.3 24.45,32.3 21.66,35.09
EMS_TX  (via drill 0.5 pad 0.95)
  Top 0.356: 28.36,48.78 28.33,48.78 | 31.57,49.83 31.48,49.48
  Top 0.61: 28.33,48.78 28.93,49.32
  Top 0.914: 28.33,48.78 D8.C | 29.41,49.83 28.36,48.78 | 29.41,49.83 31.57,49.83 39.92,49.83 40.96,48.78 v40.96,45 | 31.48,49.48 R25.1 | 29.41,49.83 24.84,49.83 23.57,48.56 D5.2 23.57,46.91 23.31,46.52 23.31,44.62 23.57,44.36 D6.2
  Bottom 0.914: R23.1 46.55,41.7 46.55,44.15 R24.1 46.55,43.98 | R23.1 46.55,41.44 | 46.55,39.16 R22.1 | R22.1 R21.1 | 46.55,41.61 46.55,39.16 | 46.55,41.61 R23.1 | R22.1 R11.1 46.49,39.1 46.55,39.16 | 46.55,41.61 46.55,44.24 44.52,44.24 43.25,43.22 42.23,43.22 40.96,44.49 v40.96,45
GND  (via drill 0.3, 0.5 pad 0.95)
  Top 0.15: R7.1 47.57,10.96
  Top 0.356: 55.44,47.41 57.6,47.41 57.98,47.03 IC2.6 | 71.36,47.79 IC2.29 71.44,47.79 | v67.51,48.94 68.65,47.79 71.44,47.79 | 71.44,47.79 v72.97,47.79 | 37.66,11.47 S1.1
  Top 0.381: R31.2 64.2,66.21
  Top 0.813: 65.86,67.99 65.86,70.15
  Top 0.914: 36.39,68.11 36.4,68.61 | S3.5 S3.6 v38.17,9.44 36.65,9.44 34.11,11.73 34.11,13.5 | R7.1 45.79,10.96 43.25,13.5 34.11,13.5 | 55.44,33.06 v55.44,40.68 55.44,47.41 v55.44,49.32 | 55.44,33.06 v55.44,29.25 | 34.11,13.5 v34.11,16.55 34.11,19.35 35.38,20.62 42.49,20.62 43.76,21.63 43.76,26.71 | v81.1,34.71 81.1,29.89 SV1.7 | v45.03,67.61 45.03,66.08 45.28,66.08 C7.2 | 36.39,68.11 36.39,60.94 36.96,60.37 41.6,60.37 42.23,59.73 IC7.1 | v36.39,68.62 36.39,68.11 | L3.1 arc-90 39.95,26.61 40.31,26.61 40.41,26.71 43.76,26.71 | 15.27,60.51 16.92,60.51 C6.2 16.9,60.81 17.72,61.76 17.98,62.02 21.02,62.02 21.79,61.26 v21.79,59.75 | v65.35,42.97 v65.35,47.83 | J7.2 v31.06,14.01 | 38.68,11.42 38.68,11.47 37.79,11.47 | 37.66,11.35 37.66,11.47 37.79,11.47 | 37.66,9.57 37.66,11.35 | 37.66,11.35 37.79,11.47 | 55.44,33.06 55.25,32.87 C1.2 52.39,33.06 50.62,33.06 J1.1 50.23,31.63 49.76,31.16 45.47,31.16 IC5.4 45.16,28.11 43.76,26.71 | 64.2,66.21 65.86,67.99 | 65.86,70.15 SV10.2 | v26.25,57.07 26.25,56.24 C21.- 21.8,56.08 v21.8,57.07 | v26.12,59.73 28.64,59.73 29.79,60.88 29.79,61.53 D3.A
  Top 1.27: SV3.9 59.76,61.64 61.54,63.42 61.54,68.11 61.53,70.65 60.47,71.72 R27.1 51.3,71.72 49.6,70.02 SV4.1
  Bottom 0.356: v26.25,57.07 26.12,57.32
  Bottom 0.914: v38.17,9.44 R1.2 | v55.44,29.25 SV5.5 | v55.44,40.68 JP8.3 | 76.65,11.09 75.51,12.23 SV2.9 | 45.03,68.62 v36.39,68.62 | 45.03,68.62 v45.03,67.61 | v81.1,34.71 80.71,35.09 74.24,35.09 72.59,36.75 71.7,36.75 v65.35,42.97 | v65.35,47.83 65.39,47.83 65.86,48.3 66.87,48.3 v67.51,48.94 67.89,49.32 67.89,51.22 75.38,58.72 SV11.1 | v31.06,14.01 v34.11,16.55 | 49.6,68.75 SV4.1 45.03,68.62 | 26.12,57.32 v26.12,59.73 | v21.79,59.75 v21.8,57.07 | SV3.9
  Bottom 1.27: v55.44,49.32 56.59,50.33 56.59,52.62 54.93,54.27 54.93,58.84 55.82,59.73 SV3.9
  other vias: 72.97,50.23 80.97,41.19 78.17,56.3 14.42,66.08 20.26,66.21 9.98,65.19 11.12,57.57 22.93,2.58 12.52,7.54 56.59,3.47 41.34,14.65 73.98,18.84 61.28,68.37 75.32,58.63 44.39,56.68 12.26,63.29 21.02,68.75 44.9,62.4 71.06,20.49 67.63,27.86 28.01,52.37 37.03,52.75 68.78,61.76 52.14,30.4 56.2,12.62 61.03,13.89 33.61,57.19 31.07,54.91 48.84,62.27 60.27,62.65 55.44,37.51 60.52,40.3 61.28,71.42
  pour Bottom: 0.07,47.03 17.34,47.03 21.91,51.6 46.81,51.6 51.38,47.29 51.38,31.79 28.52,31.79 28.52,14.27 0.07,14.27 0.07,4.88 20.01,4.88 20.01,-0.08 82.11,-0.08 81.98,72.94 20.01,72.94 20.01,68.37 0.07,68.37
  pour Top: 0.07,47.03 17.34,47.03 21.91,51.6 46.81,51.6 51.38,47.29 51.38,31.79 28.52,31.79 28.52,14.27 0.07,14.27 0.07,4.88 20.01,4.88 20.01,-0.08 82.11,-0.08 81.98,72.94 20.01,72.94 20.01,68.37 0.07,68.37
GND2  (via drill 0.3)
  Top 0.356: 25.29,22.88 24.79,22.88 IC3.5
  Top 0.914: JP4.2 25.82,27.95
  other vias: 26.99,22.9 24.33,18.08 13.79,18.84 2.86,18.46 4.77,18.46
  pour Top: 27.76,15.03 0.07,15.03 0.07,31.79 21.41,31.79 22.93,30.27 27.76,30.27
  pour Bottom: 27.76,15.03 0.07,15.03 0.07,31.79 21.41,31.79 22.93,30.27 27.76,30.27
MCLR/  (via drill 0.3)
  Top 0.356: 35.65,19.36 v35.88,19.6 | S3.4 35.63,19.09 35.65,19.36 | S3.4 35.63,16.3 | v35.63,14.52 S3.4 | 35.65,19.36 35.65,19.33 36.01,19.09 S1.8 | SV13.4 77.54,38.9 76.27,37.63 76.27,35.98 75.51,35.22 v72.59,35.22 | v66.11,33.06 66.11,38.4 v67.13,39.41
  Bottom 0.356: R4.2 v35.63,14.52 | v35.88,19.6 36.39,20.11 65.35,20.11 66.11,20.87 66.11,32.3 | J8.2 58.24,33.57 58.74,33.06 63.57,33.06 SV5.2 v66.11,33.06 66.11,32.3 | v72.59,35.22 71.95,35.86 71.32,35.86 67.63,39.41 v67.13,39.41 | R4B.2 67.21,31.2 66.11,32.3
MCLR/_IC2
  Top 0.356: IC2.18 66.4,39.83 62.3,35.73 SV5.1
  Bottom 0.356: J8.1 SV5.1
N$1
  Top 0.914: L2.1 17.95,38.4 20.71,41.16 | D6.3 21.33,40.53 20.71,41.16 | 20.71,41.16 C9.2
N$2
  Top 0.356: IC2.31 76.27,49.43 | 76.27,49.43 Q1.2 | 76.27,49.43 80.08,49.43 C2.2
N$3
  Top 0.356: IC2.30 76.27,48.63 | 76.27,48.63 Q1.1 | 76.27,48.63 80.08,48.63 C3.2
N$4
  Top 0.356: R27.2 59,69.92 59,69.89 51.38,69.89 50.87,69.38 50.87,67.35 SV4.3
N$5  (via drill 0.3)
  Top 0.356: v47.82,13 52.39,13 T1.C
  Bottom 0.356: v47.82,13 46.04,11.22 R6.2
N$6  (via drill 0.3)
  Top 0.356: J3.2 28.01,17.31 27.5,17.31 27.06,17.76 27.06,21 26.42,21.63 IC3.6 v19.88,21.63 | v19.88,16.55 20.96,16.55 U1.1
  Bottom 0.356: v19.88,16.55 v19.88,21.63
N$7
  Top 0.356: X2.2 3.94,38.3 | TP1.TP
  Top 0.914: X2.2 TP1.TP | 3.94,38.3 12.25,38.3 L2.2
N$8
  Top 0.356: X2.1 3.91,43.22
  Top 0.914: 3.91,43.22 L1.2
N$9
  Bottom 0.356: R11.2 R12.1 38.17,38.99 38.17,37.22 37.54,36.59 35.03,36.59 34.99,36.56 C10.1 33.09,35.63 32.77,35.32 28.3,35.32 28.01,35.61 C11.1
N$10
  Bottom 0.356: R13.2 R12.2
  Bottom 0.914: R13.2 R14.2 | R12.2 36.37,42.89 D7.A
N$11
  Bottom 0.356: R16.2 R17.1 26.21,43.96 25.85,43.6 IC1.1
N$12
  Bottom 0.356: R13.1 31.34,39.04 | C10.2 31.19,39 R13.1 | IC1.3 29.22,39.73 29.85,39.1 R13.1
N$13
  Bottom 0.15: R14.1 31.31,41.7
  Bottom 0.356: 31.31,44.15 R15.1 | R14.1 29.72,41.64 29.03,40.94 25.91,40.94 arc-90 IC1.2 25.78,40.94 24.2,40.94 23.44,40.17 23.44,37.38 24.26,36.56 C11.2
  Bottom 0.914: R15.1 31.31,43.98 | 31.31,41.7 31.31,44.15
N$14
  Top 0.356: T1.E 53.41,10.96 53.41,8.17 R5.1
N$15
  Top 0.356: 15.75,17.82 U1.7 11.83,17.82 | 11.83,17.82 D10.1 | 11.83,17.82 11.83,18.26 10.74,19.35 L5.2
N$16
  Top 0.356: U1.6 17.6,19.09 18.1,18.58 18.1,15.69 17.57,15.16 13.61,15.16 13.02,15.79 12.97,15.85 D10.2 11.27,15.85 10.32,16.81 L5.1
N$17  (via drill 0.3)
  Top 0.356: 39.44,16.48 S3.3 | 39.44,16.48 S3.2 40.71,17.82 40.33,18.2 S1.6 39.06,19.1 S1.7 | v39.44,14.52 39.44,16.48
  Bottom 0.356: 39.44,13 40.71,13 R2.1 | 39.44,13 38.17,13 R1.1 | 39.44,13 v39.44,14.52
N$18  (via drill 0.5 pad 0.95)
  Top 0.914: IC6.8 35.13,46.78 v34.49,47.41 33.85,48.05 R25.2 33.18,45.85 32.96,45.64 | 32.96,45.64 32.84,45.51 32.07,45.51 31.57,46.02 30.86,46.02 C12.1 | D9.C 33.17,45.43 32.96,45.64 | C20.+ 45.03,48.56 v43.76,49.83
  Bottom 0.914: v43.76,49.83 36.65,49.83 v34.49,47.41
N$19  (via drill 0.3)
  Top 0.356: S3.8 S3.7 v40.71,9.44 40.08,10.08 S1.3 S1.4
  Bottom 0.356: R3.2 43.25,11.22 40.71,11.22 R2.2 v40.71,9.44
N$20
  Top 0.356: X1.1 3.84,29.25 2.1,29.25 1.25,28.4 L5.4
  Top 0.787: X1.1 7.4,29.21 8.71,30.52 SV9.2
N$21
  Bottom 0.356: R21.2 48.33,36.62
  Bottom 0.914: R22.2 48.33,38.9 | R23.2 48.33,41.7 48.33,44.07 R24.2 | R24.2 48.33,43.98 | R22.2 48.33,39.16 48.33,41.53 R23.2 | R23.2 48.33,41.44 | 48.33,36.62 48.33,38.99 R22.2 | T2.3 46.62,46.71 48.23,45.1 R24.2
N$22  (via drill 0.3)
  Top 0.559: v17.85,40.17 17.85,42.46 v18.61,43.22
  Bottom 0.356: R18.1 18.1,45.48
  Bottom 0.559: IC1.5 18.29,38.46 17.85,38.9 v17.85,40.17 | R18.1 18.1,45.41 18.1,43.73 v18.61,43.22
  Bottom 0.914: R18.1 arc-90 18.13,45.51 19.12,45.51 19.63,46.02 19.63,47.29 20.14,47.79 21,47.79 R19.2
N$23  (via drill 0.3)
  Top 0.508: v42.74,44.49 42.74,48.56 40.43,50.82 23.74,50.87 18.87,46.02 16.07,46.02 14.04,43.98 v14.04,40.94
  Bottom 0.356: IC1.7 16.32,41 R20.2 16.25,40.94 16.07,40.75 16.07,40.94 v14.04,40.94 | T2.1 42.79,44.54 v42.74,44.49
N$24  (via drill 0.6)
  Top 0.914: L1.1 15.74,43.65 16.83,44.75 20.58,44.75 C9.1 20.77,44.62 20.77,44.87 21.28,44.87 v22.42,43.73 | 24.5,45.64 D5.3 24.45,45.55 24.84,45.25 v24.84,44.11
  Bottom 0.914: v22.42,43.73 24.45,43.73 v24.84,44.11
N$25
  Top 0.356: D1.C 47.31,6.14 47.31,8.42 D2.A
N$26
  Top 0.356: 26.91,29.25 JP4.4 | DC1.4 | L4.2
  Top 0.914: DC1.4 23.25,28.78 23.72,29.25 26.91,29.25 | 20.64,27.99 L4.2 | 20.64,27.99 DC1.4 | C16.2 20.15,28 20.64,27.99
N$27
  Top 0.356: 3.92,24.17 X1.2 3.88,17.82 2.86,16.81 L5.3
  Top 0.787: R26.1 8.54,23.32 7.69,24.17 3.92,24.17
  Top 0.914: X1.2 TP2.TP
N$28
  Top 0.356: J2.2 26.91,15.12 26.42,15.6 26.42,17.26 26.42,20.05 26.11,20.36 IC3.7 20.96,20.36 U1.4
N$29
  Top 0.787: SV6.1 5.15,11.47 7.18,11.47 8.71,13 21.91,13 SV7.1 23.44,11.47 25.22,11.47 26.49,12.74 J7.1
N$30  (via drill 0.3)
  Top 0.356: R9.1 12.96,61.64 | 12.96,61.64 | v28.11,68.47 28.16,68.47 28.26,68.5 | v23.95,64.3 21.91,64.33 R8.2 19.6,64.33 17.6,66.34 15.82,66.34 14.68,65.19 14.68,63.8 12.96,62.08 12.96,61.64
  Top 0.381: 28.26,68.5 32.2,68.5 32.73,67.96 IC4.19
  Bottom 0.381: v23.95,64.3 v28.11,68.47
N$31
  Top 0.787: SV6.3 5.15,8.93 6.93,8.93 9.72,11.73 20.64,11.73 SV7.3
N$32
  Top 0.356: SV6.5 4.92,6.62 6.9,6.62 10.99,10.71 19.12,10.71 SV7.5
N$33
  Top 0.356: 50.87,10.96 51.38,10.96 T1.B | 50.87,10.96 R7.2 | 50.87,10.96 50.87,8.42 D2.C
N$34  (via drill 0.5 pad 0.95)
  Top 0.914: B1.+ 18.21,58.38 | D3.C 29.71,58.46 | 35.38,58.21 35.44,58.01 | D3.C 29.71,58.46 | 32.33,58.97 C4.1 | 29.63,58.38 D3.C | 23.95,58.38 C21.+ | J12.2 18.1,58.33 | 35.44,56.94 J14.1
  Top 1.143: v34.8,58.78 34.8,58.95
  Top 1.27: 18.1,58.33 B1.+ | D3.C D4.C | 29.71,58.46 30.8,58.46 31.31,58.97 32.33,58.97 | 35.38,58.21 v34.8,58.78 34.55,59.03 C4.1 | 18.21,58.38 23.95,58.38 29.63,58.38 | 35.44,58.01 35.44,56.94 | 34.8,58.95 34.74,58.97 37.41,58.97 37.41,58.84 37.65,58.84 IC7.3
N$35
  Bottom 0.787: SV6.2 20.39,12.74 21.66,11.47 23.44,11.47 SV7.2
N$36
  Top 0.914: 28.21,27.97 DC1.2 29.51,29.16 JP4.3 29.7,29.51 34.36,29.51 34.61,29.26 C15.2 | C15.2 34.87,29.25 36.85,29.25 L3.3 | C15.2
N$37
  Top 0.356: 30.72,27.98 30.8,27.98 | DC1.1 30.93,27.92
  Top 0.914: JP4.1 30.72,27.98 | 30.8,27.98 DC1.1 34.16,27.98 C15.1 35.38,26.77 35.38,26.71 36.89,26.71 L3.4
N$38
  Bottom 0.787: SV6.4 8.2,11.73 18.87,11.73 21.66,8.93 23.44,8.93 SV7.4
N$39  (via drill 0.3)
  Top 0.356: v20.14,60.49 18.62,60.49 C6.1 | v29.79,69.26 29.92,69.26
  Top 0.381: 29.92,69.26 IC4.17
  Bottom 0.356: v20.14,60.49 20.14,61.51 | 27.88,69.26 v29.79,69.26
  Bottom 0.381: 20.14,61.51 27.88,69.26
N$40
  Bottom 0.356: SV6.6 9.72,10.96 17.85,10.96 20.9,7.92 20.9,7.15 21.66,6.39 23.44,6.39 SV7.6
N$41  (via drill 0.3)
  Top 0.356: SV8.1 R28.2 | LED1.A 4.87,33.09 5.4,32.55 21.91,32.55 23.57,30.9 v34.21,30.9 34.23,30.9
  Bottom 0.356: v34.21,30.9 35.63,29.51 35.63,24.17 36.9,22.9 SV8.1
N$42  (via drill 0.3)
  Top 0.356: SV8.3 R29.2 | LED2.A 21.66,33.82 23.95,31.54 v35.12,31.54
  Top 0.914: SV8.3 36.65,24.68
  Bottom 0.356: v35.12,31.54 36.9,29.76 SV8.3
N$43
  Top 0.356: U1.5 C18.2
N$44
  Top 0.914: JP7.2 13.02,52.26
  Top 1.27: 13.02,52.26 B1.~1 15.53,53.86 15.56,54.4 J13.1 | X4.1 10.95,52.67 11.5,52.11 JP7.2
  Bottom 1.27: JP7.2
N$45
  Bottom 0.914: SV4.16 R30.2
N$46
  Top 0.787: R26.2 10.23,25.95 11.5,27.22 SV9.1
N$47  (via drill 0.5 pad 0.95)
  Top 0.914: B1.~2 18.1,52.39
  Top 1.27: v10.73,55.17 9.98,55.16 X4.3 | 18.13,51.63 B1.~2 | 18.13,51.63 16.07,49.57 JP7.1 11.5,49.57 10.71,50.37 X4.2 | J12.1 19.63,53.13 18.13,51.63
  Bottom 1.27: v10.73,55.17 14.04,55.16 15.06,54.14 15.06,50.33 14.29,49.58 13.02,49.57 JP7.1
N$48
  Top 0.356: 11.26,64.1 L6.2 11.37,64.66 11.37,64.3 11.5,63.92 | C8.1 10.74,61.64
  Top 0.508: 11.26,64.1 X3.1 | 10.74,61.64 11.5,62.4 11.5,63.92
RA0  (via drill 0.3)
  Top 0.356: SV8.2 34.36,22.9 34.87,23.41 v37.66,23.41 | v56.46,21.63 v56.46,18.84 | SV1.1 71.06,28.49 67.89,31.67 67.89,39.67 67.2,40.35 IC2.19
  Top 0.914: LED1.C v3.12,33.82
  Bottom 0.356: v3.12,33.82 4.13,33.82 5.4,32.55 21.91,32.55 23.57,30.9 31.95,30.9 33.09,29.76 33.09,23.41 SV8.2 | v37.66,23.41 37.66,23.16 39.19,21.63 v56.46,21.63 | v56.46,18.84 71.57,18.84 73.35,20.62 73.35,25.57 72.08,26.84 SV1.1
RA1  (via drill 0.3)
  Top 0.356: IC2.20 68,40.31 68.52,39.79 68.52,32.05 69.54,31.03 SV1.2 72.08,30.52 73.35,29.25 v73.35,26.71 | v55.7,20.87 v55.7,18.33
  Top 0.914: LED2.C v8.71,33.82
  Bottom 0.356: v8.71,33.82 21.66,33.82 23.95,31.54 32.33,31.54 34.36,29.51 SV8.4 34.36,24.17 35.63,22.9 35.63,21.63 36.39,20.87 v55.7,20.87 | v55.7,18.33 55.95,18.2 72.08,18.2 74.11,20.24 74.11,25.95 v73.35,26.71
RA2  (via drill 0.3)
  Top 0.356: SV1.3 74.62,29.25 73.35,30.52 73.35,31.41 72.59,32.17 69.54,32.17 69.16,32.55 69.16,40.05 68.8,40.4 IC2.21 68.8,42.05 68.52,42.46 68.01,42.46 66.24,44.24 66.24,49.7 67.76,51.22 v69.28,51.22 | SV11.3 72.59,58.59 72.59,56.3 72.21,55.92 v72.21,54.02
  Bottom 0.356: v69.28,51.22 72.08,54.02 v72.21,54.02
RA3  (via drill 0.3)
  Top 0.356: SV1.4 73.73,31.92 72.59,33.06 70.68,33.06 69.79,33.95 69.79,40.3 69.6,40.49 IC2.22 69.6,42.14 68.65,43.1 68.27,43.1 66.87,44.49 66.87,49.19 67.89,50.21 69.16,50.21 v69.28,50.33 | SV10.9 74.75,67.48 75.89,66.34 75.89,62.91 71.82,58.84 71.82,56.43 71.44,56.05 v71.44,52.49
  Bottom 0.356: v69.28,50.33 69.41,50.33 71.44,52.37 v71.44,52.49
RA4  (via drill 0.3)
  Top 0.356: v37.66,63.42 37.66,68.37 38.55,69.26 IC4.12 | v76.27,17.06 77.16,17.95 SV1.5 78.3,29.63 78.3,31.41 75.25,34.46 71.32,34.46 v71.19,34.59 71.15,34.76 71.1,34.76 71.06,34.71 71.06,42.71 71.38,43.03 IC2.23
  Bottom 0.356: v76.27,17.06 72.97,17.06 72.59,16.68 35.76,16.68 33.09,14.01 R10.2 | v71.19,34.59 71.06,34.46 70.3,34.46 62.55,42.21 62.55,43.48 62.05,43.98 53.92,43.98 53.41,44.49 50.36,44.49 50.36,47.03 48.46,48.81 48.46,51.1 44.27,55.29 42.11,55.29 37.66,59.73 v37.66,63.42
RA5  (via drill 0.3)
  Top 0.356: IC2.24 70.78,43.83 70.81,43.86 70.43,43.86 70.05,43.48 70.05,42.71 70.43,42.33 70.43,34.33 70.94,33.82 74.36,33.82 SV1.6 | v43.25,14.77 S3.1 43.25,18.58 42.74,19.09 41.61,19.09 S1.5 | v73.73,16.3 75.89,18.46 75.89,29.76 SV1.6 | SV1.6
  Bottom 0.356: v43.25,14.77 R3.1 arc90 R3.1 R6.1 45.79,13 45.79,15.03 46.68,15.92 73.35,15.92 v73.73,16.3
RB0  (via drill 0.3)
  Top 0.356: IC2.8 59.76,45.43 58.54,45.43 58.49,45.38 57.98,44.92 v57.98,43.22 57.98,22.39 61.28,19.09 63.82,19.09 64.59,18.33 64.59,17.57 62.3,15.28 62.3,13.5 SV2.1 | SV2.1
  Bottom 0.356: v57.98,43.22 JP8.2
RB1  (via drill 0.3)
  Top 0.356: v61.44,44.62 59.89,44.62 59.81,44.7 IC2.9 | v56.46,44.62 v56.46,38.14 56.46,27.98 54.68,26.2 54.68,16.04 v55.95,14.77
  Bottom 0.356: v56.46,44.62 v61.44,44.62 | v56.46,38.14 JP8.4 | v55.95,14.77 SV2.2 | SV2.2
RB2  (via drill 0.3)
  Top 0.356: 65.35,16.3 64.84,15.54 | 65.35,16.3 65.35,18.58 v64.46,19.47 64.08,19.85 61.54,19.85 58.67,22.72 58.67,43.53 59,43.86 59.76,43.83 IC2.10 | 64.84,13.5 SV2.3 | J3.1 30.39,17.35 32.96,19.98 v32.96,20.24 32.84,20.3 31.51,21.63 IC3.3 | SV2.3 | 64.84,13.5 SV2.3 | 64.84,15.54 64.84,13.5 | 64.84,15.54 64.84,15.66 65.35,16.17 65.35,16.3
  Bottom 0.356: v64.46,19.47 36.9,19.47 36.39,18.97 35.5,18.97 34.23,20.24 v32.96,20.24 | SV2.3
RB3  (via drill 0.3)
  Top 0.356: v61.41,42.46 60.78,43.1 59.89,43.1 IC2.11 | v66.11,17.44 66.11,16.04 66.11,15.79 SV2.4 | SV2.4 | v31.09,16.72 31.09,15.7 30.51,15.12 J2.1 | IC3.2 31.18,20.36 v31.82,19.73
  Bottom 0.356: v61.41,42.46 70.3,33.57 80.08,33.57 80.84,32.81 80.84,19.09 79.57,17.82 72.71,17.82 72.33,17.44 v66.11,17.44 55.44,17.44 54.17,18.71 37.28,18.84 36.65,18.2 35.25,18.2 34.74,18.71 32.84,18.71 | 31.69,17.44 32.84,18.71 | 32.84,18.71 v31.82,19.73 | 31.69,17.44 32.71,18.58 32.84,18.71 | v31.09,16.72 31.69,17.44
RB4  (via drill 0.3)
  Top 0.356: IC2.14 63.19,41.55 v63.19,42.82 63.19,42.84 64.33,43.98 64.33,48.56 v65.47,49.7
  Bottom 0.356: v63.19,42.82 63.19,42.46 70.43,35.22 71.57,35.22 72.59,34.21 80.21,34.21 81.35,33.06 81.48,18.67 80.76,17.95 80.71,17.95 79.95,17.19 77.67,17.19 73.98,13.5 69.92,13.5 SV2.5 | SV2.5 | v65.47,49.7 65.47,49.83 67,51.22 67,51.48 75.38,59.99 79.06,59.99 79.7,60.62 79.7,69.38 78.94,70.15 76.4,70.15 75.13,71.42 SV10.10
RB5  (via drill 0.3)
  Top 0.356: SV2.6 66.87,16.3 66.87,20.36 65.6,21.63 SV5.12 | SV2.6 | v56.2,25.82 56.2,26.59 57.22,27.6 v57.35,45.25 | v54.81,63.67 54.43,63.29 54.43,61.89 55.57,60.75 55.57,59.61 57.35,57.83 57.35,53.13 v58.36,52.11 | v62.81,45.64 62.94,45.76 v62.94,49.57
  Bottom 0.356: J11.2 57.98,22.39 58.49,22.9 | 58.49,22.9 63.57,22.9 SV5.12 | 58.49,22.9 57.09,22.9 56.2,23.79 v56.2,25.82 | v58.36,52.11 60.52,52.11 v62.94,49.57 | v62.81,45.64 62.55,45.38 57.47,45.38 v57.35,45.25 | v54.81,63.67 61.28,70.15 68.4,70.15 SV10.5
RB5_IC2
  Top 0.356: IC2.15 64,40.48 59.51,35.98 59.51,22.9 60.78,21.63 SV5.11
  Bottom 0.356: J11.1 SV5.11
RB6  (via drill 0.3)
  Top 0.356: SV2.7 69.92,13.5 69.92,15.28 67.63,17.57 67.63,21.38 SV5.10 63.57,25.44 63.57,35.86 v64.59,36.87 | SV2.7 | v49.09,46.27 49.35,45.76 v49.35,39.41
  Top 0.381: v32.33,63.03 32.33,64.69 33,65.36 IC4.23
  Bottom 0.356: v64.59,36.87 62.05,39.41 v49.35,39.41 | v49.09,46.27 46.93,48.43 46.93,50.59 43.5,54.02 41.6,54.02 v32.33,63.03 | J10.2 57.98,24.93 58.49,25.44 63.57,25.44 SV5.10
RB6_IC2
  Top 0.356: IC2.16 64.8,40.26 60.27,35.73 60.27,25.44 61.54,24.17 SV5.9
  Bottom 0.356: J10.1 SV5.9
RB7  (via drill 0.3)
  Top 0.356: v66.87,35.98 66.87,28.74 SV5.8 64.84,25.95 68.4,22.39 68.4,17.82 70.94,15.28 SV2.8 | 34.11,66.01 IC4.22 | SV2.8
  Top 0.381: v33.09,66.01 34.11,66.01
  Bottom 0.356: v33.09,66.01 33.09,63.29 41.85,54.65 43.88,54.65 47.7,50.84 47.7,48.68 49.85,46.52 49.85,41.95 58.62,41.95 59.12,41.44 61.41,41.44 v66.87,35.98 | J9.2 57.98,27.47 58.49,27.98 63.57,27.98 SV5.8
RB7_IC2
  Top 0.356: IC2.17 65.6,40.05 61.03,35.48 61.03,27.98 SV5.7
  Bottom 0.356: J9.1 SV5.7
RC0  (via drill 0.3)
  Top 0.356: IC2.32 70.58,50.23 70.2,50.61 70.2,55.69 71.19,56.68 71.19,58.46 SV3.1 | v67.63,62.02 SV3.1 | SV3.1
  Bottom 0.356: SV4.4 53.41,64.81 53.41,63.16 54.55,62.02 v67.63,62.02
RC1
  Top 0.356: IC2.35 68.8,55.82 69.92,56.94 | 69.92,56.94 | SV3.2 69.92,56.94
  Bottom 0.356: SV4.5 50.87,62.27 52.65,62.27 53.92,61 65.35,61 66.11,60.24 66.11,59.18 66.83,58.46 68.65,58.46 SV3.2 | SV3.2
RC2
  Top 0.356: IC2.36 68,56.04 68.65,56.68 68.65,58.46 SV3.3
  Bottom 0.356: SV4.6 54.17,61.51 66.87,61.51 67.38,61 SV3.3
RC3
  Top 0.356: IC2.37 67.2,57.01 SV3.4 | SV3.4 | SV3.4 | SV3.4 67.38,57.95 66.11,59.22 66.11,61 66.11,61.51 69.79,65.19 69.79,67.1 70.94,68.24 70.94,70.15 SV10.8 73.48,70.15 76.52,70.15 SV11.6
RC4  (via drill 0.3)
  Top 0.356: IC2.42 63.2,53.78 66.11,56.68 66.11,57.7 64.84,58.97 SV3.5 64.84,61.26 v69.16,65.45
  Bottom 0.356: v69.16,65.45 72.21,68.62 SV10.7 73.09,68.88 75.63,66.34 SV11.4
RC5
  Top 0.356: IC2.43 62.4,53.99 64.84,56.43 64.84,56.68 SV3.6 64.84,58.08 63.57,59.35 63.57,60.88 68.52,65.83 68.52,70.27 SV10.6
  Bottom 0.356: SV10.6 71.06,70.02 75.38,70.02 76.52,68.88 SV11.5
RC6  (via drill 0.3)
  Top 0.15: 46.3,32.94 v46.04,32.81
  Top 0.356: J4.1 46.3,32.94 44.23,32.94 43.88,32.59 IC5.3 | v59.38,36.87 v59.38,42.21 | v61.79,43.22 62.17,43.6 62.17,51.22 61.61,51.78 61.61,52.24 IC2.44 61.6,54.21 63.57,56.18 63.57,58.46 SV3.7 62.3,60.49 64.2,62.4 R31.1
  Bottom 0.356: v46.04,32.81 47.82,34.59 50.62,34.59 52.9,36.87 v59.38,36.87 | v59.38,42.21 59.38,42.71 59.89,43.22 v61.79,43.22
RC7  (via drill 0.3)
  Top 0.356: J5.1 38.93,32.81 v40.46,32.81 42.23,32.81 42.62,32.43 IC5.2 42.49,31.28 | SV3.8 62.3,56.68 62.3,55.92 59.76,53.38 59.76,51.03 IC2.1 60.84,51.03 61.41,50.46 v61.41,47.54 | v49.6,38.14 50.36,38.9 50.36,46.97 50.93,47.54 v50.87,47.54
  Bottom 0.356: v40.46,32.81 45.03,32.81 47.57,35.35 49.09,35.35 49.6,35.86 v49.6,38.14 | v50.87,47.54 v61.41,47.54
RD0  (via drill 0.3)
  Top 0.356: IC2.38 66.4,54.87 v65.86,55.41 | v56.08,57.95 54.81,59.22 54.81,60.37 52.9,62.27 50.87,62.27 SV4.7 v45.03,61 | IC4.1 41.51,62.11 41.93,61.69 v42.56,61
  Bottom 0.356: v65.86,55.41 58.62,55.41 v56.08,57.95 | v42.56,61 v45.03,61
RD1  (via drill 0.3)
  Top 0.356: v65.09,54.65 65.6,54.14 IC2.39 | v56.08,56.94 54.17,58.84 54.17,59.61 52.77,61 SV4.8 51.12,61 49.85,59.73 v45.79,59.73 | IC4.5 42.77,64.71 v43.38,65.32
  Bottom 0.356: v65.09,54.65 58.36,54.65 v56.08,56.94 | v45.79,59.73 45.79,63.76 44.23,65.32 v43.38,65.32
RD2  (via drill 0.3)
  Top 0.356: v56.08,55.92 53.41,58.59 53.41,58.97 52.65,59.73 50.87,59.73 SV4.9 46.04,58.46 43.88,60.62 43.88,62.15 42.62,63.41 IC4.3 | v64.8,51.13 IC2.40
  Bottom 0.356: v56.08,55.92 58.11,53.89 63.78,53.89 64.8,52.87 v64.8,51.13 | v64.8,51.13 64.79,51.12 | v64.8,51.13 64.81,51.12
RD3  (via drill 0.3)
  Top 0.356: 64,51.68 v63.98,51.48 63.98,52.81 IC2.41 | v56.08,54.91 52.52,58.46 SV4.10 51.38,58.46 50.11,57.19 v47.31,57.19 | IC4.11 45.42,68.61 46.04,67.99 v46.04,67.61
  Bottom 0.356: v56.08,54.91 57.85,53.13 63.57,53.13 63.98,52.72 v63.98,51.48 | v47.31,57.19 47.31,64.3 46.04,65.57 v46.04,67.61
RD4
  Top 0.356: IC2.2 58.85,50.23 53.92,55.16 53.92,55.92 52.65,57.19 51.12,57.19 49.85,55.92 SV4.11 47.57,55.92 43.25,60.24 43.25,61.89 42.38,62.76 IC4.2
RD5  (via drill 0.3)
  Top 0.356: IC2.3 58.63,49.43 SV4.12 51.38,55.92 50.11,54.65 48.84,54.65 48.2,55.29 v46.68,55.29 | v41.09,61.38 39.95,61.38 39.19,62.15 39.19,66.78 39.75,67.35 41.47,67.35 IC4.9
  Bottom 0.356: v46.68,55.29 v41.09,61.38
RD6  (via drill 0.3)
  Top 0.356: IC2.4 58.41,48.63 52.39,54.65 50.87,54.65 SV4.13 | 41.67,67.96 IC4.10 39.03,67.96 38.42,67.35 v38.42,62.78
  Bottom 0.356: SV4.13 48.58,52.37 48.08,52.37 44.52,55.92 42.49,55.92 38.42,59.99 v38.42,62.78
RD7  (via drill 0.3)
  Top 0.356: IC2.5 58.2,47.83 52.52,53.38 SV4.14 50.87,52.11 49.09,52.11 47.44,53.76 v47.44,53.89 | IC4.6 39.99,65.36 arc90 v39.95,65.32
  Bottom 0.356: v47.44,53.89 47.44,56.05 46.55,56.94 46.55,64.05 44.61,65.99 40.62,65.99 v39.95,65.32
RE0  (via drill 0.3)
  Top 0.356: v44.77,69.89 41.73,69.89 IC4.13 | v67.62,44.63 IC2.25 71.39,44.62 | v63.57,44.75 63.57,48.94 v65.73,51.1 | v58.87,66.46 v56.33,66.46
  Bottom 0.356: v65.73,51.1 71.19,56.56 71.19,60.24 64.97,66.46 v58.87,66.46 | SV13.1 74.49,36.49 73.35,37.63 72.08,37.63 66.87,42.84 66.87,43.86 67.62,44.61 v67.62,44.63 67.61,44.62 63.7,44.62 v63.57,44.75 | v44.77,69.89 50.23,69.89 50.87,69.26 50.87,67.86 51.38,67.35 53.28,67.35 54.17,66.46 v56.33,66.46
RE1  (via drill 0.3)
  Top 0.356: v46.93,67.61 46.93,70.15 46.52,70.56 IC4.14 | v69.92,45.51 71.19,45.51 IC2.26
  Bottom 0.356: v46.93,67.61 46.93,65.7 48.08,64.56 48.08,55.41 48.84,54.65 50.11,54.65 50.87,53.89 50.87,49.57 52.27,48.18 62.17,48.18 63.44,46.91 68.52,46.91 v69.92,45.51 69.54,45 69.54,42.21 72.71,39.03 SV13.2
RE2  (via drill 0.3)
  Top 0.356: IC2.27 69.5,46.23 v68.78,45.51
  Bottom 0.356: SV13.3 76.27,37.76 74.36,37.76 73.73,38.4 72.33,38.4 68.78,41.95 v68.78,45.51
USB_VCC
  Top 0.356: 25.09,67.48 25.09,67.61 25.22,67.48 | 21.91,66.03 R8.1 | 13.02,64.65 13.04,64.65 L6.1 | 32.33,67.35 32.37,67.31
  Top 0.381: 32.37,67.31 IC4.20
  Top 0.406: 25.22,67.73 25.34,67.61 27.88,67.61 28.64,67.86 31.82,67.86 32.33,67.35
  Top 0.508: 25.22,67.48 25.34,67.61 25.38,67.57
  Top 1.067: 13.02,64.65 13.02,66.34 14.17,67.48 21.91,67.48 | 21.91,67.48 21.91,66.03 | J15.2 25.09,67.48 21.91,67.48
USBD+1  (via drill 0.3)
  Top 0.356: 10.23,62.5 v10.23,62.53
  Top 0.381: IC4.15 v28.1,70.56 v28.11,70.55
  Top 0.508: X3.3 10.23,62.5
  Bottom 0.381: v28.11,70.55 19.01,61.4 11.36,61.4 v10.23,62.53
USBD-1  (via drill 0.3)
  Top 0.356: v10.75,63.3 v10.74,63.29 | v26.23,69.64 26.5,69.91
  Top 0.381: v26.23,69.64 26.46,69.89 | 26.5,69.91 IC4.16
  Top 0.508: X3.2 v10.75,63.3
  Bottom 0.381: v26.23,69.64 18.73,62.14 11.88,62.14 v10.74,63.29
VCC2
  Top 0.356: 15.41,25.28 C17.2
  Top 0.584: U1.3 20.96,19.09
  Top 0.61: 15.41,25.28 17.79,25.28 18.48,24.2 18.48,19.98 19.38,19.09 U1.3 24.78,19.09 | 25.47,19.09 25.46,19.09 24.78,19.09 | 24.78,19.09 IC3.8
  Top 0.914: C17.2 15.33,27.89 15.42,27.98 L4.1
(copper drawn outside any net)
  shapes: Top area x2

### Text on the board
tNames: Ingo Fischer 2013 | USB | EMS | 4: Reset | 3: Mode 2^2 | 2: Mode 2^1 | 1: Mode 2^0 | 1 | 0 | 2^2 | 2^1 | 2^0 | Reset | Mode | EMS Gateway V2.1
bNames: RE0..2, RD0..7 | Ingo Fischer 2013 | LCD | ETH. | USB | SD& | RC0..7 | MMC | DC-in | PS/2 | RE0..3 | EMS | RA0..5 | CAN | ISCP | RB0..7 | EMS Gateway V2.1